# Altium project MPG2.PrjPcb
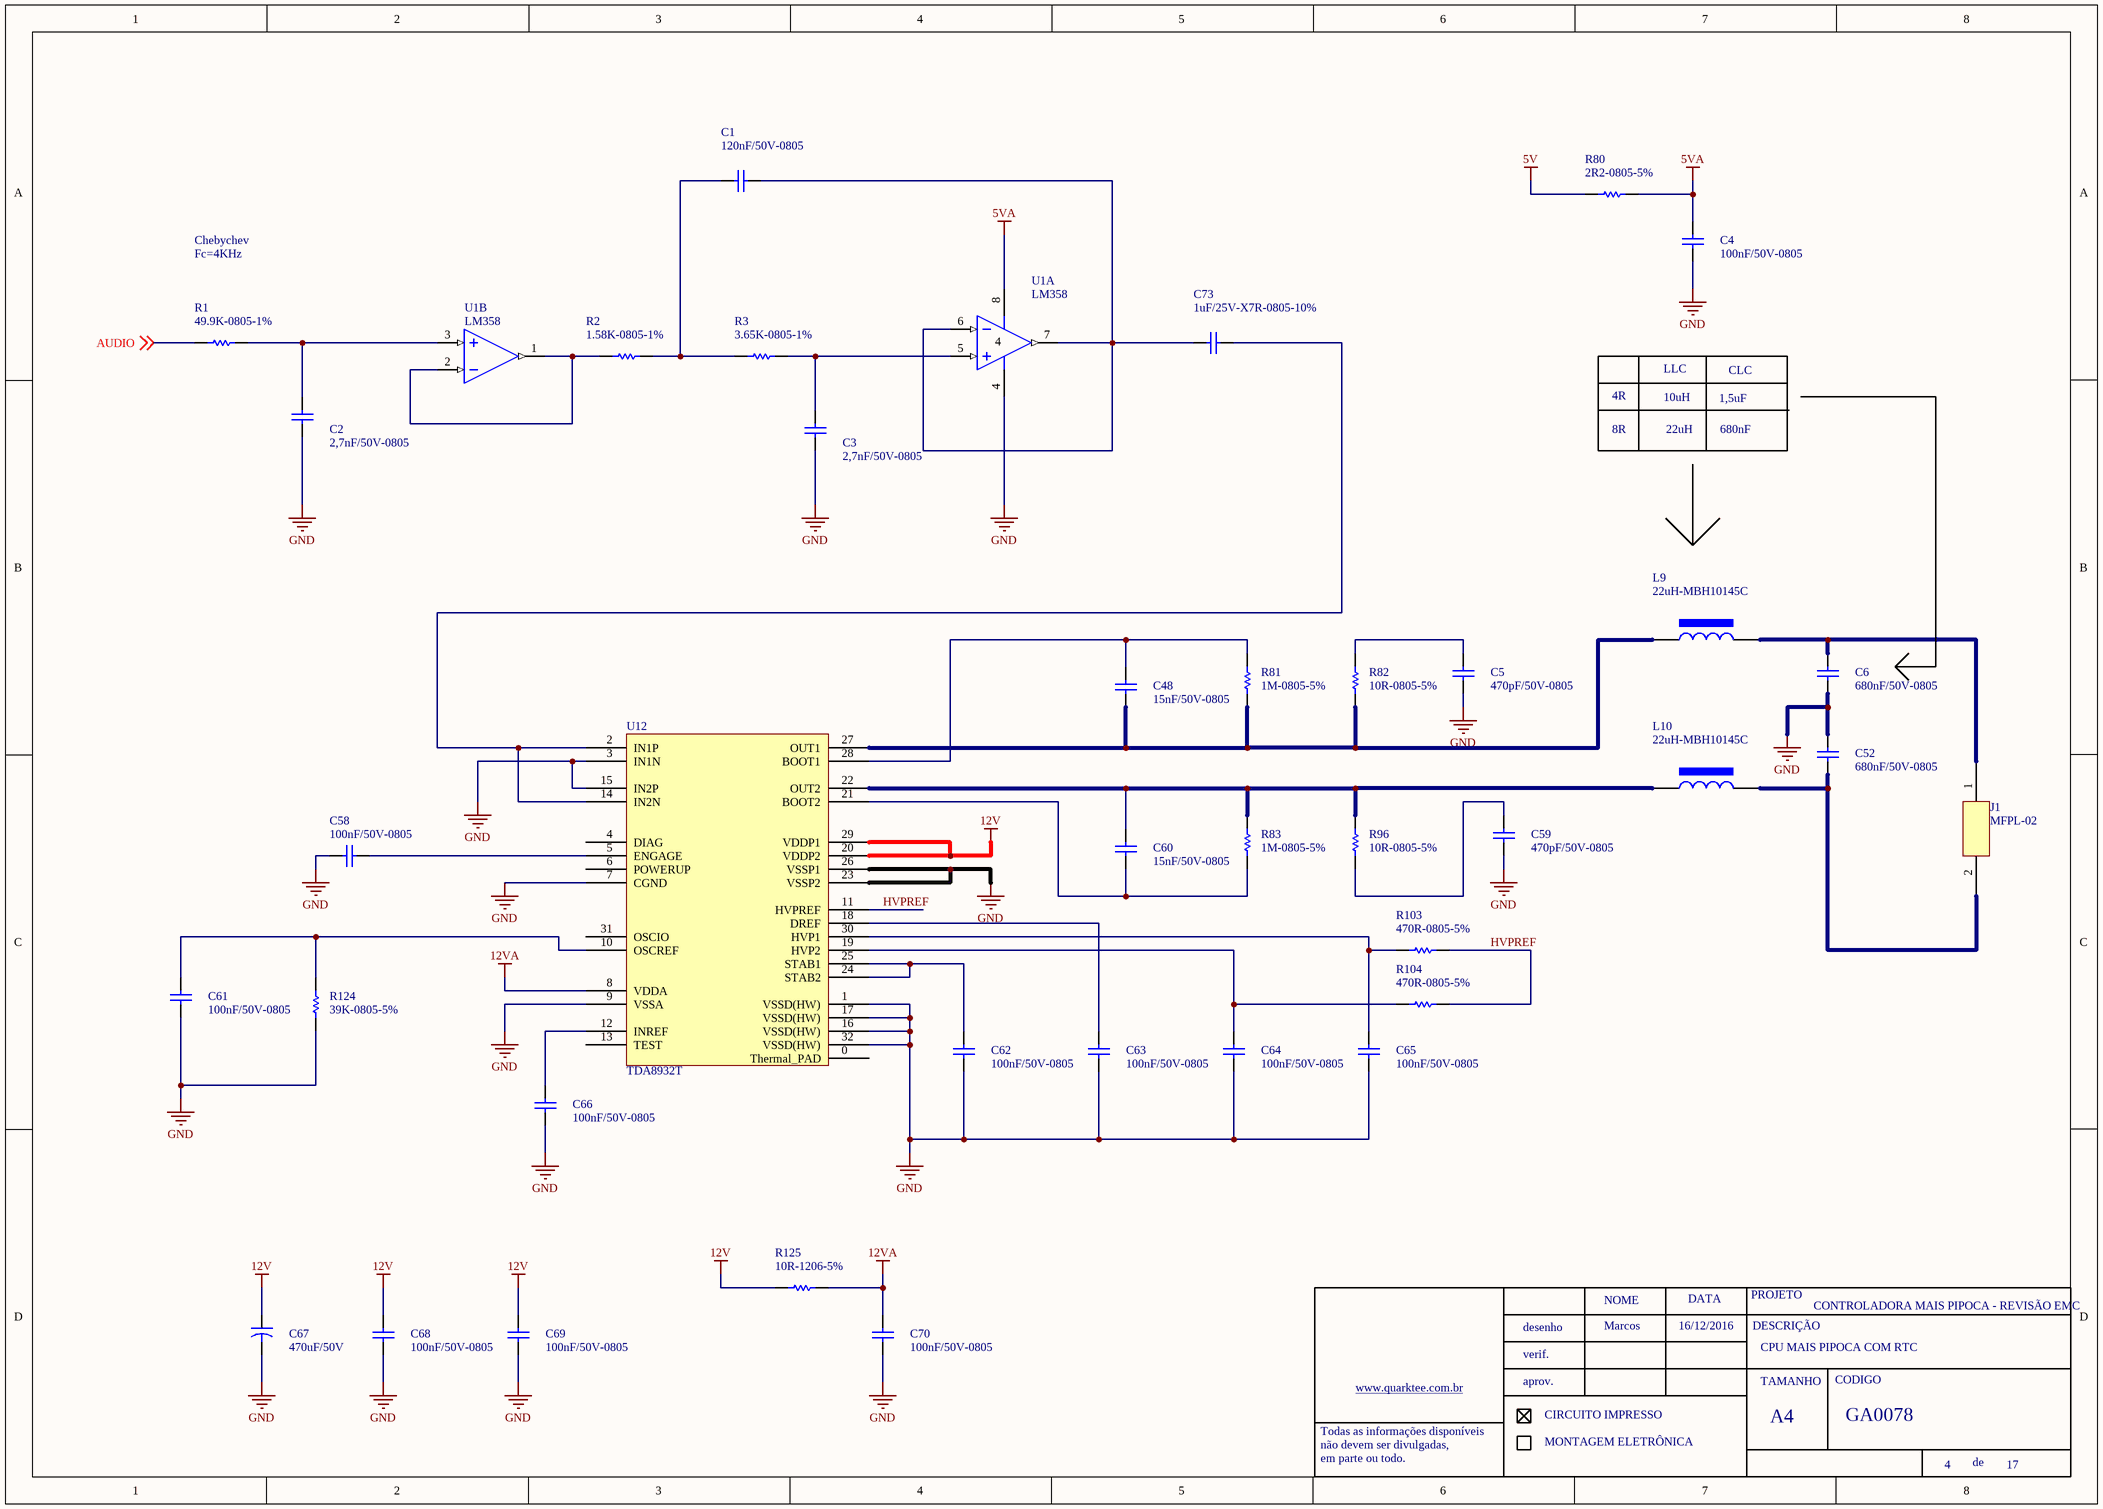
[diagram p0: amplificadorAudio.SchDoc]
9 sheets, 195 parts. Net scope: global (net labels, ports and power ports of the same name join across sheets).
Sheets:
  amplificadorAudio.SchDoc
  Barreira_pacote.SchDoc
  CPU.SchDoc
  IHM.SchDoc
  InterfaceConfiguracao.SchDoc
  JTAG.SchDoc
  Meios_pagamento.SchDoc
  Porta_MDB.SchDoc
  Regulador.SchDoc

## Sheet amplificadorAudio.SchDoc: CONTROLADORA MAIS PIPOCA - REVISÃO EMC
size A3; DocumentNumber: GA0078; SheetNumber: 4; SheetTotal: 17

### Parts
C1  120nF/50V-0805  [0805-REVISADO ONDA]
C2  2,7nF/50V-0805  [0805-REVISADO ONDA]
C3  2,7nF/50V-0805  [0805-REVISADO ONDA]
C4  100nF/50V-0805  [0805-REVISADO ONDA]
C5  470pF/50V-0805  [0805-REVISADO ONDA]
C6  680nF/50V-0805  [0805-REVISADO ONDA]
C48  15nF/50V-0805  [0805-REVISADO ONDA]
C52  680nF/50V-0805  [0805-REVISADO ONDA]
C58  100nF/50V-0805  [0805-REVISADO ONDA]
C59  470pF/50V-0805  [0805-REVISADO ONDA]
C60  15nF/50V-0805  [0805-REVISADO ONDA]
C61  100nF/50V-0805  [0805-REVISADO ONDA]
C62  100nF/50V-0805  [0805-REVISADO ONDA]
C63  100nF/50V-0805  [0805-REVISADO ONDA]
C64  100nF/50V-0805  [0805-REVISADO ONDA]
C65  100nF/50V-0805  [0805-REVISADO ONDA]
C66  100nF/50V-0805  [0805-REVISADO ONDA]
C67  470uF/50V
C68  100nF/50V-0805  [0805-REVISADO ONDA]
C69  100nF/50V-0805  [0805-REVISADO ONDA]
C70  100nF/50V-0805  [0805-REVISADO ONDA]
C73  1uF/25V-X7R-0805-10%  [0805-REVISADO ONDA]
J1  MFPL-02  [MFPL-02]
L9  22uH-MBH10145C
L10  22uH-MBH10145C
R1  49.9K-0805-1%  [0805-REVISADO ONDA]
R2  1.58K-0805-1%  [0805-REVISADO ONDA]
R3  3.65K-0805-1%  [0805-REVISADO ONDA]
R80  2R2-0805-5%
R81  1M-0805-5%  [0805-REVISADO ONDA]
R82  10R-0805-5%  [0805-REVISADO ONDA]
R83  1M-0805-5%  [0805-REVISADO ONDA]
R96  10R-0805-5%  [0805-REVISADO ONDA]
R103  470R-0805-5%  [0805-REVISADO ONDA]
R104  470R-0805-5%  [0805-REVISADO ONDA]
R124  39K-0805-5%  [0805-REVISADO ONDA]
R125  10R-1206-5%
U1  LM358  (parts A,B of 2)
U12  TDA8932T

### Nets
5V: R80.1
5VA: C4.2 R80.2 U1.8(V+)
12V: C67.1 C68.2 C69.2 R125.1 U12.20(VDDP2) U12.29(VDDP1)
12VA: C70.2 R125.2 U12.8(VDDA)
GND: C2.1 C3.1 C4.1 C5.1 C6.1 C52.2 C58.2 C59.1 C61.1 C62.1 C63.1 C64.1 C65.1 C66.1 C67.2 C68.1 C69.1 C70.1 R124.1 U1.4(GND) U12.1(VSSD(HW)) U12.3(IN1N) U12.7(CGND) U12.9(VSSA) U12.15(IN2P) U12.16(VSSD(HW)) U12.17(VSSD(HW)) U12.23(VSSP2) U12.26(VSSP1) U12.32(VSSD(HW))
AUDIO: R1.1 ; off-sheet AUDIO
HVPREF: R103.1 R104.1 U12.11(HVPREF)
NetC1_1: C1.1 C73.2 U1.6(IN-) U1.7(OUT)
NetC1_2: C1.2 R2.2 R3.1
NetC2_2: C2.2 R1.2 U1.3(IN+)
NetC3_2: C3.2 R3.2 U1.5(IN+)
NetC5_2: C5.2 R82.1
NetC6_2: C6.2 J1.1 L9.1
NetC48_1: C48.1 L9.2 R81.2 R82.2 U12.27(OUT1)
NetC48_2: C48.2 R81.1 U12.28(BOOT1)
NetC52_1: C52.1 J1.2 L10.1
NetC58_1: C58.1 U12.5(ENGAGE)
NetC59_2: C59.2 R96.2
NetC60_1: C60.1 R83.2 U12.21(BOOT2)
NetC60_2: C60.2 L10.2 R83.1 R96.1 U12.22(OUT2)
NetC61_2: C61.2 R124.2 U12.10(OSCREF)
NetC62_2: C62.2 U12.24(STAB2) U12.25(STAB1)
NetC63_2: C63.2 U12.18(DREF)
NetC64_2: C64.2 R104.2 U12.19(HVP2)
NetC65_2: C65.2 R103.2 U12.30(HVP1)
NetC66_2: C66.2 U12.12(INREF)
NetC73_1: C73.1 U12.2(IN1P) U12.14(IN2N)
NetR2_1: R2.1 U1.1(OUT) U1.2(IN-)

Not connected (* = marked no-connect by the designer): U12 0(Thermal_PAD) 4(DIAG) 6(POWERUP) 13(TEST) 31(OSCIO)

### Notes on the sheet
- Chebychev
- Fc=4KHz
- LLC
- CLC
- 4R
- 8R
- 10uH
- 22uH
- 1,5uF
- 680nF
- Marcos
- 16/12/2016
- CPU MAIS PIPOCA COM RTC
- NOME
- DATA
- PROJETO
- DESCRIÇÃO
- www.quarktee.com.br
- desenho
- verif.
- aprov.
- TAMANHO
- CODIGO
- Todas as informações disponíveis
- não devem ser divulgadas,
- em parte ou todo.
- CIRCUITO IMPRESSO
- MONTAGEM ELETRÔNICA
- A4
- de

### Library data of the parts
C1-C3 C5 C6 C48 C52 C59 C60 C73 = 100nF/50-0805-NPO: 100nF/50V-0805; ERP: 104.11.005
C4 C58 C61-C66 C68-C70 = 100nF/50-0805-NPO: ERP: 104.11.005
L9 L10 = indutor 1mH CNF15: 1mH-CNF15-26 AWG; ERP: 211.00.012
R1-R3 R81-R83 R96 R103 R104 R124 = 10K-0805-5%: ERP: 102.11.054
R80 R125 = 10R-0805-5%: ERP: 102.11.019
U1 = LM358: ERP: 10802003
C67 = 470uF/50V: ERP: 105.01.005

## Sheet Barreira_pacote.SchDoc: CONTROLADORA MAIS PIPOCA - REVISÃO EMC
size A3; DocumentNumber: GA0078; SheetNumber: 16; SheetTotal: 17
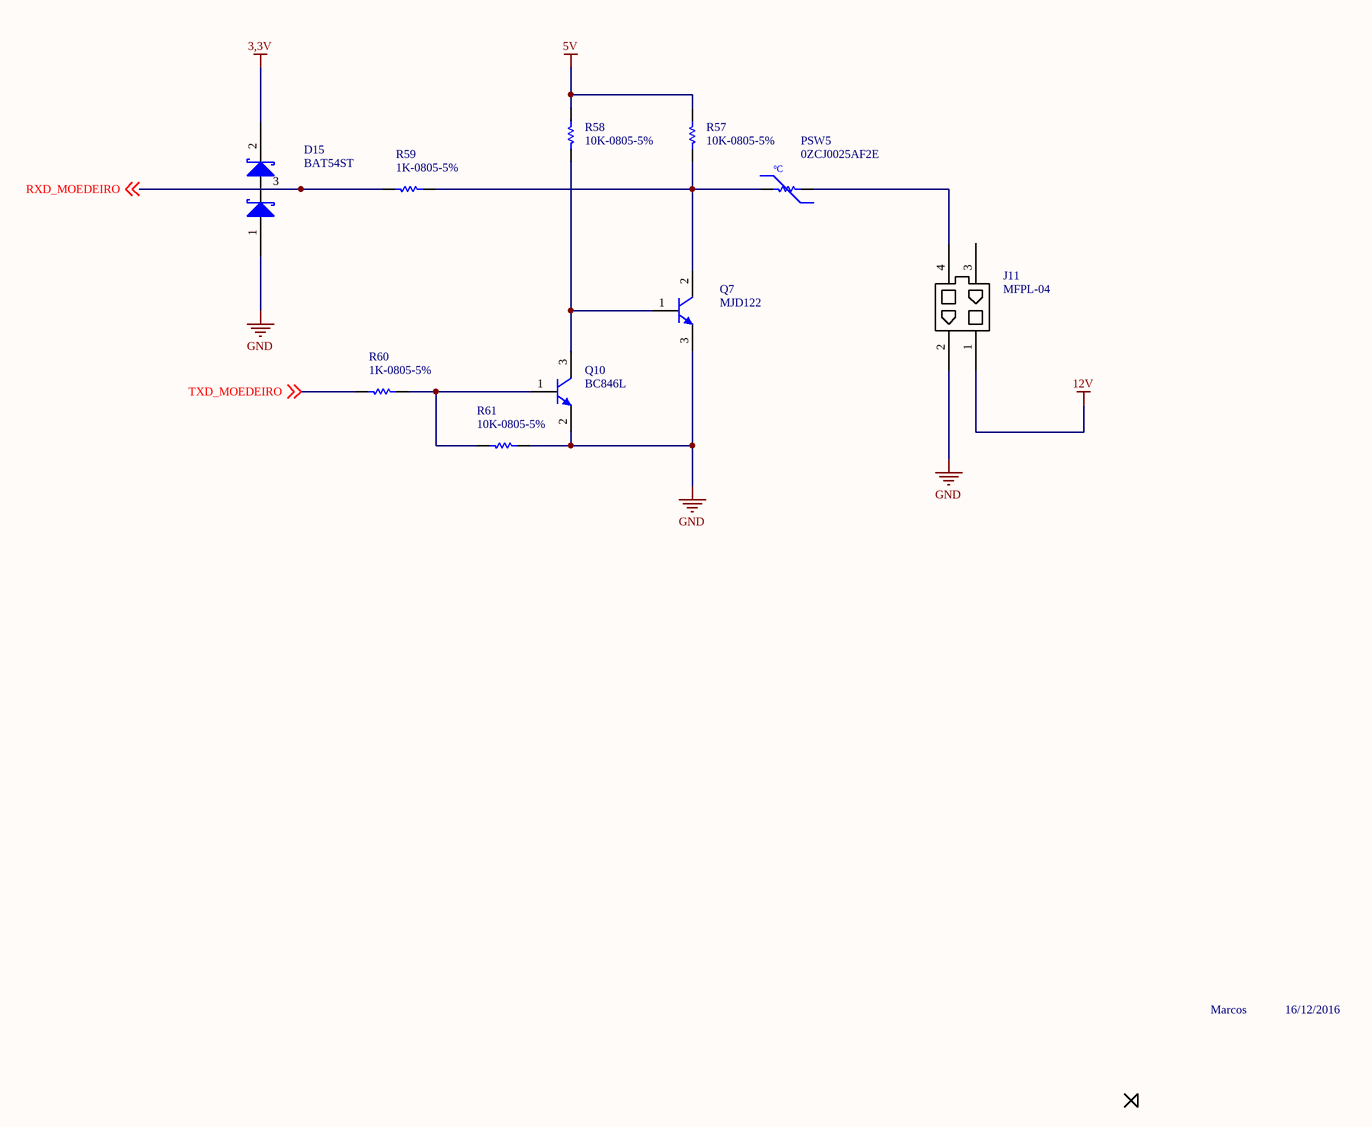
[diagram p1: Barreira_pacote.SchDoc]

### Parts
D15  BAT54ST  [SOT23 - REVISADO ONDA]
J11  MFPL-04
PSW5  0ZCJ0025AF2E  [1206-REVISADO ONDA]
Q7  MJD122  [DPAK REVISADO ONDA]
Q10  BC846L  [SOT23 - REVISADO ONDA]
R57  10K-0805-5%  [0805-REVISADO ONDA]
R58  10K-0805-5%  [0805-REVISADO ONDA]
R59  1K-0805-5%  [0805-REVISADO ONDA]
R60  1K-0805-5%  [0805-REVISADO ONDA]
R61  10K-0805-5%  [0805-REVISADO ONDA]

### Nets
3,3V: D15.2
5V: R57.2 R58.2
12V: J11.1
GND: D15.1 J11.2 Q7.3(E) Q10.2(E) R61.1
RXD_MOEDEIRO: D15.3 R59.2 ; off-sheet RXD_MOEDEIRO
TXD_MOEDEIRO: R60.2 ; off-sheet TXD_MOEDEIRO
NetJ11_4: J11.4 PSW5.1
NetPSW5_2: PSW5.2 Q7.2(C) R57.1 R59.1
NetQ7_1: Q7.1(B) Q10.3(C) R58.1
NetQ10_1: Q10.1(B) R60.1 R61.2

Not connected (* = marked no-connect by the designer): J11 3

### Notes on the sheet
- Marcos
- 16/12/2016
- NOME
- DATA
- PROJETO
- DESCRIÇÃO
- desenho
- verif.
- aprov.
- TAMANHO
- CODIGO
- Todas as informações disponíveis
- não devem ser divulgadas,
- em parte ou todo.
- www.quarktee.com.br
- CIRCUITO IMPRESSO
- MONTAGEM ELETRÔNICA
- A4
- de
- (in symbol PTC 2A-120V) ºC

### Library data of the parts
PSW5 = PTC 2A-120V
Q7 = MJD31
Q10 = BC846: ERP: 106.22.001
R57 R58 R61 = 10K-0805-5%: ERP: 102.11.054
R59 R60 = 1K-0805-5%: ERP: 102.11.042

## Sheet CPU.SchDoc: CONTROLADORA MAIS PIPOCA - REVISÃO EMC
size A3; DocumentNumber: GA0078; SheetNumber: 3; SheetTotal: 17
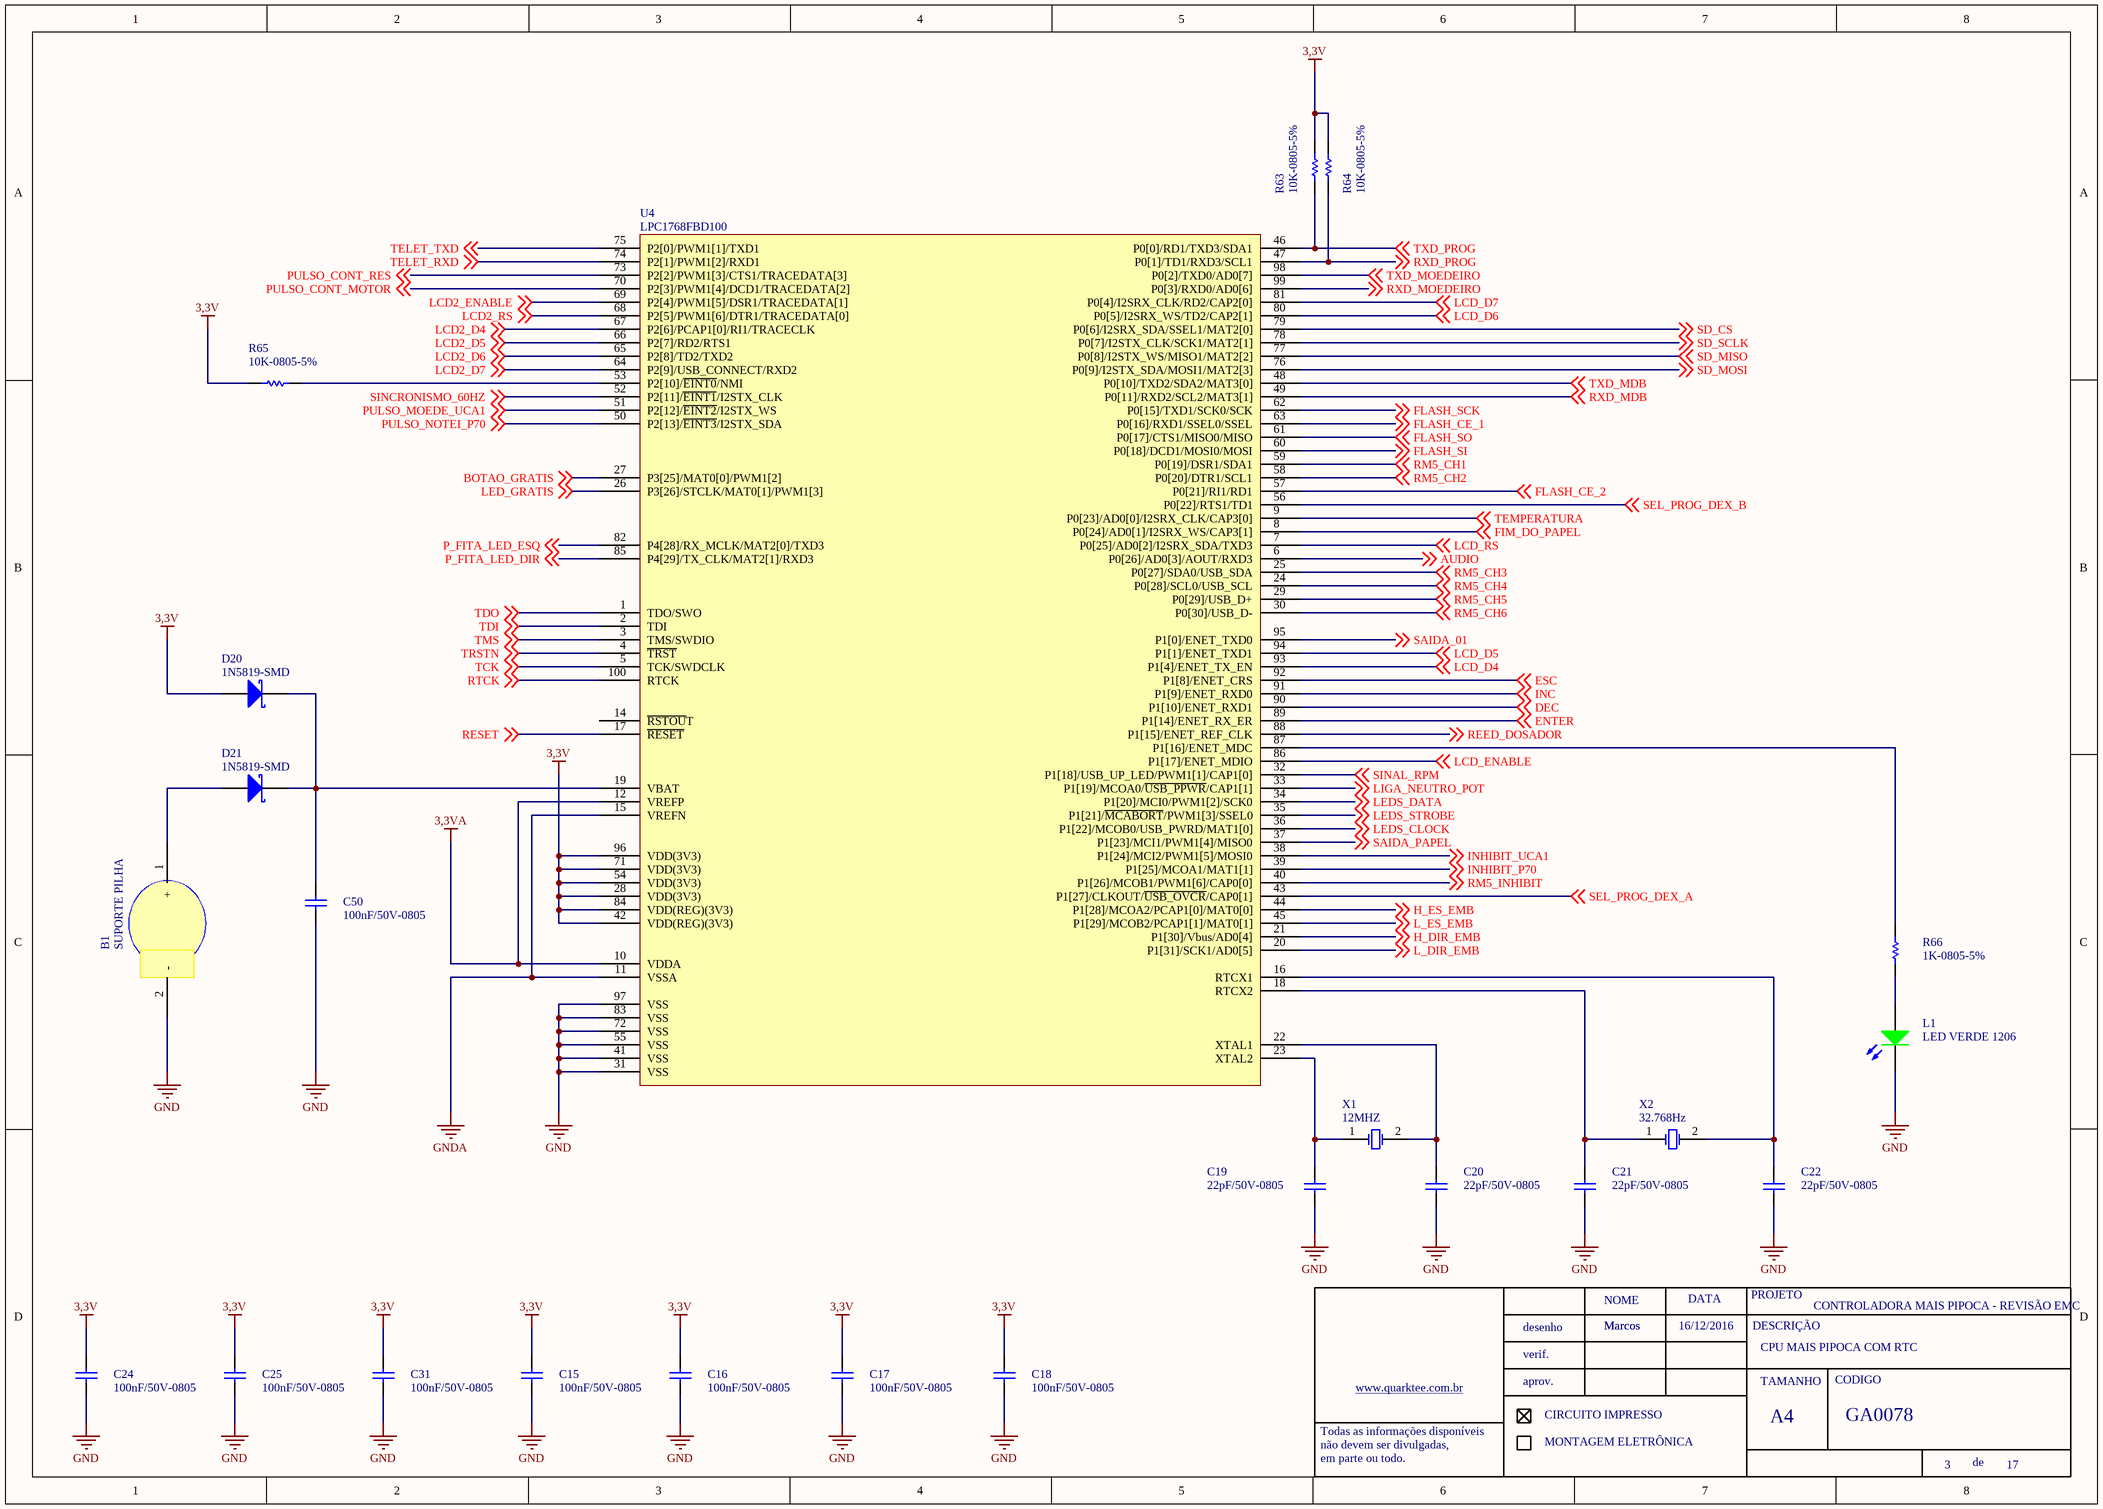
[diagram p2: CPU.SchDoc]

### Parts
B1  SUPORTE PILHA  [SUPORTE PILHA CR2032]
C15  100nF/50V-0805  [0805-REVISADO ONDA]
C16  100nF/50V-0805  [0805-REVISADO ONDA]
C17  100nF/50V-0805  [0805-REVISADO ONDA]
C18  100nF/50V-0805  [0805-REVISADO ONDA]
C19  22pF/50V-0805  [0805-REVISADO ONDA]
C20  22pF/50V-0805  [0805-REVISADO ONDA]
C21  22pF/50V-0805  [0805-REVISADO ONDA]
C22  22pF/50V-0805  [0805-REVISADO ONDA]
C24  100nF/50V-0805  [0805-REVISADO ONDA]
C25  100nF/50V-0805  [0805-REVISADO ONDA]
C31  100nF/50V-0805  [0805-REVISADO ONDA]
C50  100nF/50V-0805  [0805-REVISADO ONDA]
D20  1N5819-SMD
D21  1N5819-SMD
L1  LED VERDE 1206  [LED 1206]
R63  10K-0805-5%  [0805-REVISADO ONDA]
R64  10K-0805-5%  [0805-REVISADO ONDA]
R65  10K-0805-5%  [0805-REVISADO ONDA]
R66  1K-0805-5%  [0805-REVISADO ONDA]
U4  LPC1768FBD100  [LQFP-100 pasta]
X1  12MHZ  [HC49USM]
X2  32.768Hz  [CRISTAL TH3]

### Nets
3,3V: C15.2 C16.2 C17.2 C18.2 C24.2 C25.2 C31.2 D20.1(A) R63.2 R64.2 R65.1 U4.28(VDD(3V3)) U4.42(VDD(REG)(3V3)) U4.54(VDD(3V3)) U4.71(VDD(3V3)) U4.84(VDD(REG)(3V3)) U4.96(VDD(3V3))
3,3VA: U4.10(VDDA) U4.12(VREFP)
GND: B1.2(-) C15.1 C16.1 C17.1 C18.1 C19.1 C20.1 C21.1 C22.1 C24.1 C25.1 C31.1 C50.1 L1.2(K) U4.31(VSS) U4.41(VSS) U4.55(VSS) U4.72(VSS) U4.83(VSS) U4.97(VSS)
GNDA: U4.11(VSSA) U4.15(VREFN)
AUDIO: U4.6(P0[26]/AD0[3]/AOUT/RXD3) ; off-sheet AUDIO
BOTAO_GRATIS: U4.27(P3[25]/MAT0[0]/PWM1[2]) ; off-sheet BOTAO_GRATIS
DEC: U4.90(P1[10]/ENET_RXD1) ; off-sheet DEC
ENTER: U4.89(P1[14]/ENET_RX_ER) ; off-sheet ENTER
ESC: U4.92(P1[8]/ENET_CRS) ; off-sheet ESC
FIM_DO_PAPEL: U4.8(P0[24]/AD0[1]/I2SRX_WS/CAP3[1]) ; off-sheet FIM_DO_PAPEL
FLASH_CE_1: U4.63(P0[16]/RXD1/SSEL0/SSEL) ; off-sheet FLASH_CE_1
FLASH_CE_2: U4.57(P0[21]/RI1/RD1) ; off-sheet FLASH_CE_2
FLASH_SCK: U4.62(P0[15]/TXD1/SCK0/SCK) ; off-sheet FLASH_SCK
FLASH_SI: U4.60(P0[18]/DCD1/MOSI0/MOSI) ; off-sheet FLASH_SI
FLASH_SO: U4.61(P0[17]/CTS1/MISO0/MISO) ; off-sheet FLASH_SO
H_DIR_EMB: U4.21(P1[30]/Vbus/AD0[4]) ; off-sheet H_DIR_EMB
H_ES_EMB: U4.44(P1[28]/MCOA2/PCAP1[0]/MAT0[0]) ; off-sheet H_ES_EMB
INC: U4.91(P1[9]/ENET_RXD0) ; off-sheet INC
INHIBIT_P70: U4.39(P1[25]/MCOA1/MAT1[1]) ; off-sheet INHIBIT_P70
INHIBIT_UCA1: U4.38(P1[24]/MCI2/PWM1[5]/MOSI0) ; off-sheet INHIBIT_UCA1
L_DIR_EMB: U4.20(P1[31]/SCK1/AD0[5]) ; off-sheet L_DIR_EMB
L_ES_EMB: U4.45(P1[29]/MCOB2/PCAP1[1]/MAT0[1]) ; off-sheet L_ES_EMB
LCD2_D4: U4.67(P2[6]/PCAP1[0]/RI1/TRACECLK) ; off-sheet LCD2_D4
LCD2_D5: U4.66(P2[7]/RD2/RTS1) ; off-sheet LCD2_D5
LCD2_D6: U4.65(P2[8]/TD2/TXD2) ; off-sheet LCD2_D6
LCD2_D7: U4.64(P2[9]/USB_CONNECT/RXD2) ; off-sheet LCD2_D7
LCD2_ENABLE: U4.69(P2[4]/PWM1[5]/DSR1/TRACEDATA[1]) ; off-sheet LCD2_ENABLE
LCD2_RS: U4.68(P2[5]/PWM1[6]/DTR1/TRACEDATA[0]) ; off-sheet LCD2_RS
LCD_D4: U4.93(P1[4]/ENET_TX_EN) ; off-sheet LCD_D4
LCD_D5: U4.94(P1[1]/ENET_TXD1) ; off-sheet LCD_D5
LCD_D6: U4.80(P0[5]/I2SRX_WS/TD2/CAP2[1]) ; off-sheet LCD_D6
LCD_D7: U4.81(P0[4]/I2SRX_CLK/RD2/CAP2[0]) ; off-sheet LCD_D7
LCD_ENABLE: U4.86(P1[17]/ENET_MDIO) ; off-sheet LCD_ENABLE
LCD_RS: U4.7(P0[25]/AD0[2]/I2SRX_SDA/TXD3) ; off-sheet LCD_RS
LED_GRATIS: U4.26(P3[26]/STCLK/MAT0[1]/PWM1[3]) ; off-sheet LED_GRATIS
LEDS_CLOCK: U4.36(P1[22]/MCOB0/USB_PWRD/MAT1[0]) ; off-sheet LEDS_CLOCK
LEDS_DATA: U4.34(P1[20]/MCI0/PWM1[2]/SCK0) ; off-sheet LEDS_DATA
LEDS_STROBE: U4.35(P1[21]/~{MCABORT}/PWM1[3]/SSEL0) ; off-sheet LEDS_STROBE
LIGA_NEUTRO_POT: U4.33(P1[19]/MCOA0/~{USB_PPWR}/CAP1[1]) ; off-sheet LIGA_NEUTRO_POT
P_FITA_LED_DIR: U4.85(P4[29]/TX_CLK/MAT2[1]/RXD3) ; off-sheet P_FITA_LED_DIR
P_FITA_LED_ESQ: U4.82(P4[28]/RX_MCLK/MAT2[0]/TXD3) ; off-sheet P_FITA_LED_ESQ
PULSO_CONT_MOTOR: U4.70(P2[3]/PWM1[4]/DCD1/TRACEDATA[2]) ; off-sheet PULSO_CONT_MOTOR
PULSO_CONT_RES: U4.73(P2[2]/PWM1[3]/CTS1/TRACEDATA[3]) ; off-sheet PULSO_CONT_RES
PULSO_MOEDE_UCA1: U4.51(P2[12]/~{EINT2}/I2STX_WS) ; off-sheet PULSO_MOEDE_UCA1
PULSO_NOTEI_P70: U4.50(P2[13]/~{EINT3}/I2STX_SDA) ; off-sheet PULSO_NOTEI_P70
REED_DOSADOR: U4.88(P1[15]/ENET_REF_CLK) ; off-sheet REED_DOSADOR
RESET: U4.17(~{RESET}) ; off-sheet RESET
RM5_CH1: U4.59(P0[19]/DSR1/SDA1) ; off-sheet RM5_CH1
RM5_CH2: U4.58(P0[20]/DTR1/SCL1) ; off-sheet RM5_CH2
RM5_CH3: U4.25(P0[27]/SDA0/USB_SDA) ; off-sheet RM5_CH3
RM5_CH4: U4.24(P0[28]/SCL0/USB_SCL) ; off-sheet RM5_CH4
RM5_CH5: U4.29(P0[29]/USB_D+) ; off-sheet RM5_CH5
RM5_CH6: U4.30(P0[30]/USB_D-) ; off-sheet RM5_CH6
RM5_INHIBIT: U4.40(P1[26]/MCOB1/PWM1[6]/CAP0[0]) ; off-sheet RM5_INHIBIT
RTCK: U4.100(RTCK) ; off-sheet RTCK
RXD_MDB: U4.49(P0[11]/RXD2/SCL2/MAT3[1]) ; off-sheet RXD_MDB
RXD_MOEDEIRO: U4.99(P0[3]/RXD0/AD0[6]) ; off-sheet RXD_MOEDEIRO
RXD_PROG: R64.1 U4.47(P0[1]/TD1/RXD3/SCL1) ; off-sheet RXD_PROG
SAIDA_01: U4.95(P1[0]/ENET_TXD0) ; off-sheet SAIDA_01
SAIDA_PAPEL: U4.37(P1[23]/MCI1/PWM1[4]/MISO0) ; off-sheet SAIDA_PAPEL
SD_CS: U4.79(P0[6]/I2SRX_SDA/SSEL1/MAT2[0]) ; off-sheet SD_CS
SD_MISO: U4.77(P0[8]/I2STX_WS/MISO1/MAT2[2]) ; off-sheet SD_MISO
SD_MOSI: U4.76(P0[9]/I2STX_SDA/MOSI1/MAT2[3]) ; off-sheet SD_MOSI
SD_SCLK: U4.78(P0[7]/I2STX_CLK/SCK1/MAT2[1]) ; off-sheet SD_SCLK
SEL_PROG_DEX_A: U4.43(P1[27]/CLKOUT/~{USB_OVCR}/CAP0[1]) ; off-sheet SEL_PROG_DEX_A
SEL_PROG_DEX_B: U4.56(P0[22]/RTS1/TD1) ; off-sheet SEL_PROG_DEX_B
SINAL_RPM: U4.32(P1[18]/USB_UP_LED/PWM1[1]/CAP1[0]) ; off-sheet SINAL_RPM
SINCRONISMO_60HZ: U4.52(P2[11]/~{EINT1}/I2STX_CLK) ; off-sheet SINCRONISMO_60HZ
TCK: U4.5(TCK/SWDCLK) ; off-sheet TCK
TDI: U4.2(TDI) ; off-sheet TDI
TDO: U4.1(TDO/SWO) ; off-sheet TDO
TELET_RXD: U4.74(P2[1]/PWM1[2]/RXD1) ; off-sheet TELET_RXD
TELET_TXD: U4.75(P2[0]/PWM1[1]/TXD1) ; off-sheet TELET_TXD
TEMPERATURA: U4.9(P0[23]/AD0[0]/I2SRX_CLK/CAP3[0]) ; off-sheet TEMPERATURA
TMS: U4.3(TMS/SWDIO) ; off-sheet TMS
TRSTN: U4.4(~{TRST}) ; off-sheet TRSTN
TXD_MDB: U4.48(P0[10]/TXD2/SDA2/MAT3[0]) ; off-sheet TXD_MDB
TXD_MOEDEIRO: U4.98(P0[2]/TXD0/AD0[7]) ; off-sheet TXD_MOEDEIRO
TXD_PROG: R63.1 U4.46(P0[0]/RD1/TXD3/SDA1) ; off-sheet TXD_PROG
NetB1_1: B1.1(+) D21.1(A)
NetC19_2: C19.2 U4.23(XTAL2) X1.1(OSC1)
NetC20_2: C20.2 U4.22(XTAL1) X1.2(OSC2)
NetC21_2: C21.2 U4.18(RTCX2) X2.1(OSC1)
NetC22_2: C22.2 U4.16(RTCX1) X2.2(OSC2)
NetC50_2: C50.2 D20.2(K) D21.2(K) U4.19(VBAT)
NetL1_1: L1.1(A) R66.1
NetR65_2: R65.2 U4.53(P2[10]/~{EINT0}/NMI)
NetR66_2: R66.2 U4.87(P1[16]/ENET_MDC)

Not connected (* = marked no-connect by the designer): U4 14(~{RSTOU}T)

### Notes on the sheet
- Marcos
- 16/12/2016
- CPU MAIS PIPOCA COM RTC
- NOME
- DATA
- PROJETO
- DESCRIÇÃO
- www.quarktee.com.br
- desenho
- verif.
- aprov.
- TAMANHO
- CODIGO
- Todas as informações disponíveis
- não devem ser divulgadas,
- em parte ou todo.
- CIRCUITO IMPRESSO
- MONTAGEM ELETRÔNICA
- A4
- de

### Library data of the parts
B1 = SUPORTE PILHA CR2032: ERP: 437.00.100
C15-C18 C24 C25 C31 C50 = 100nF/50-0805-NPO: ERP: 104.11.005
C19-C22 = 22pF-0805-NPO: ERP: 104.11.001
D20 D21 = 1N5819: ERP: 121.20.002
L1 = LED VERDE 0603 SMD: LED VERDE 0603 VERDE; ERP: 124.02.011
U4 = LPC1768FDB100: ERP: 110.02.004
X1 = CRISTAL 12MHZ: ERP: 134.01.003
X2 = CRISTAL 32.768 Hz: CRISTAL 32.768Hz; ERP: 134.01.002
R63-R65 = 10K-0805-5%: ERP: 102.11.054
R66 = 1K-0805-5%: ERP: 102.11.042

## Sheet IHM.SchDoc: CONTROLADORA MAIS PIPOCA - REVISÃO EMC
size A3; DocumentNumber: GA0078; SheetNumber: 9; SheetTotal: 17
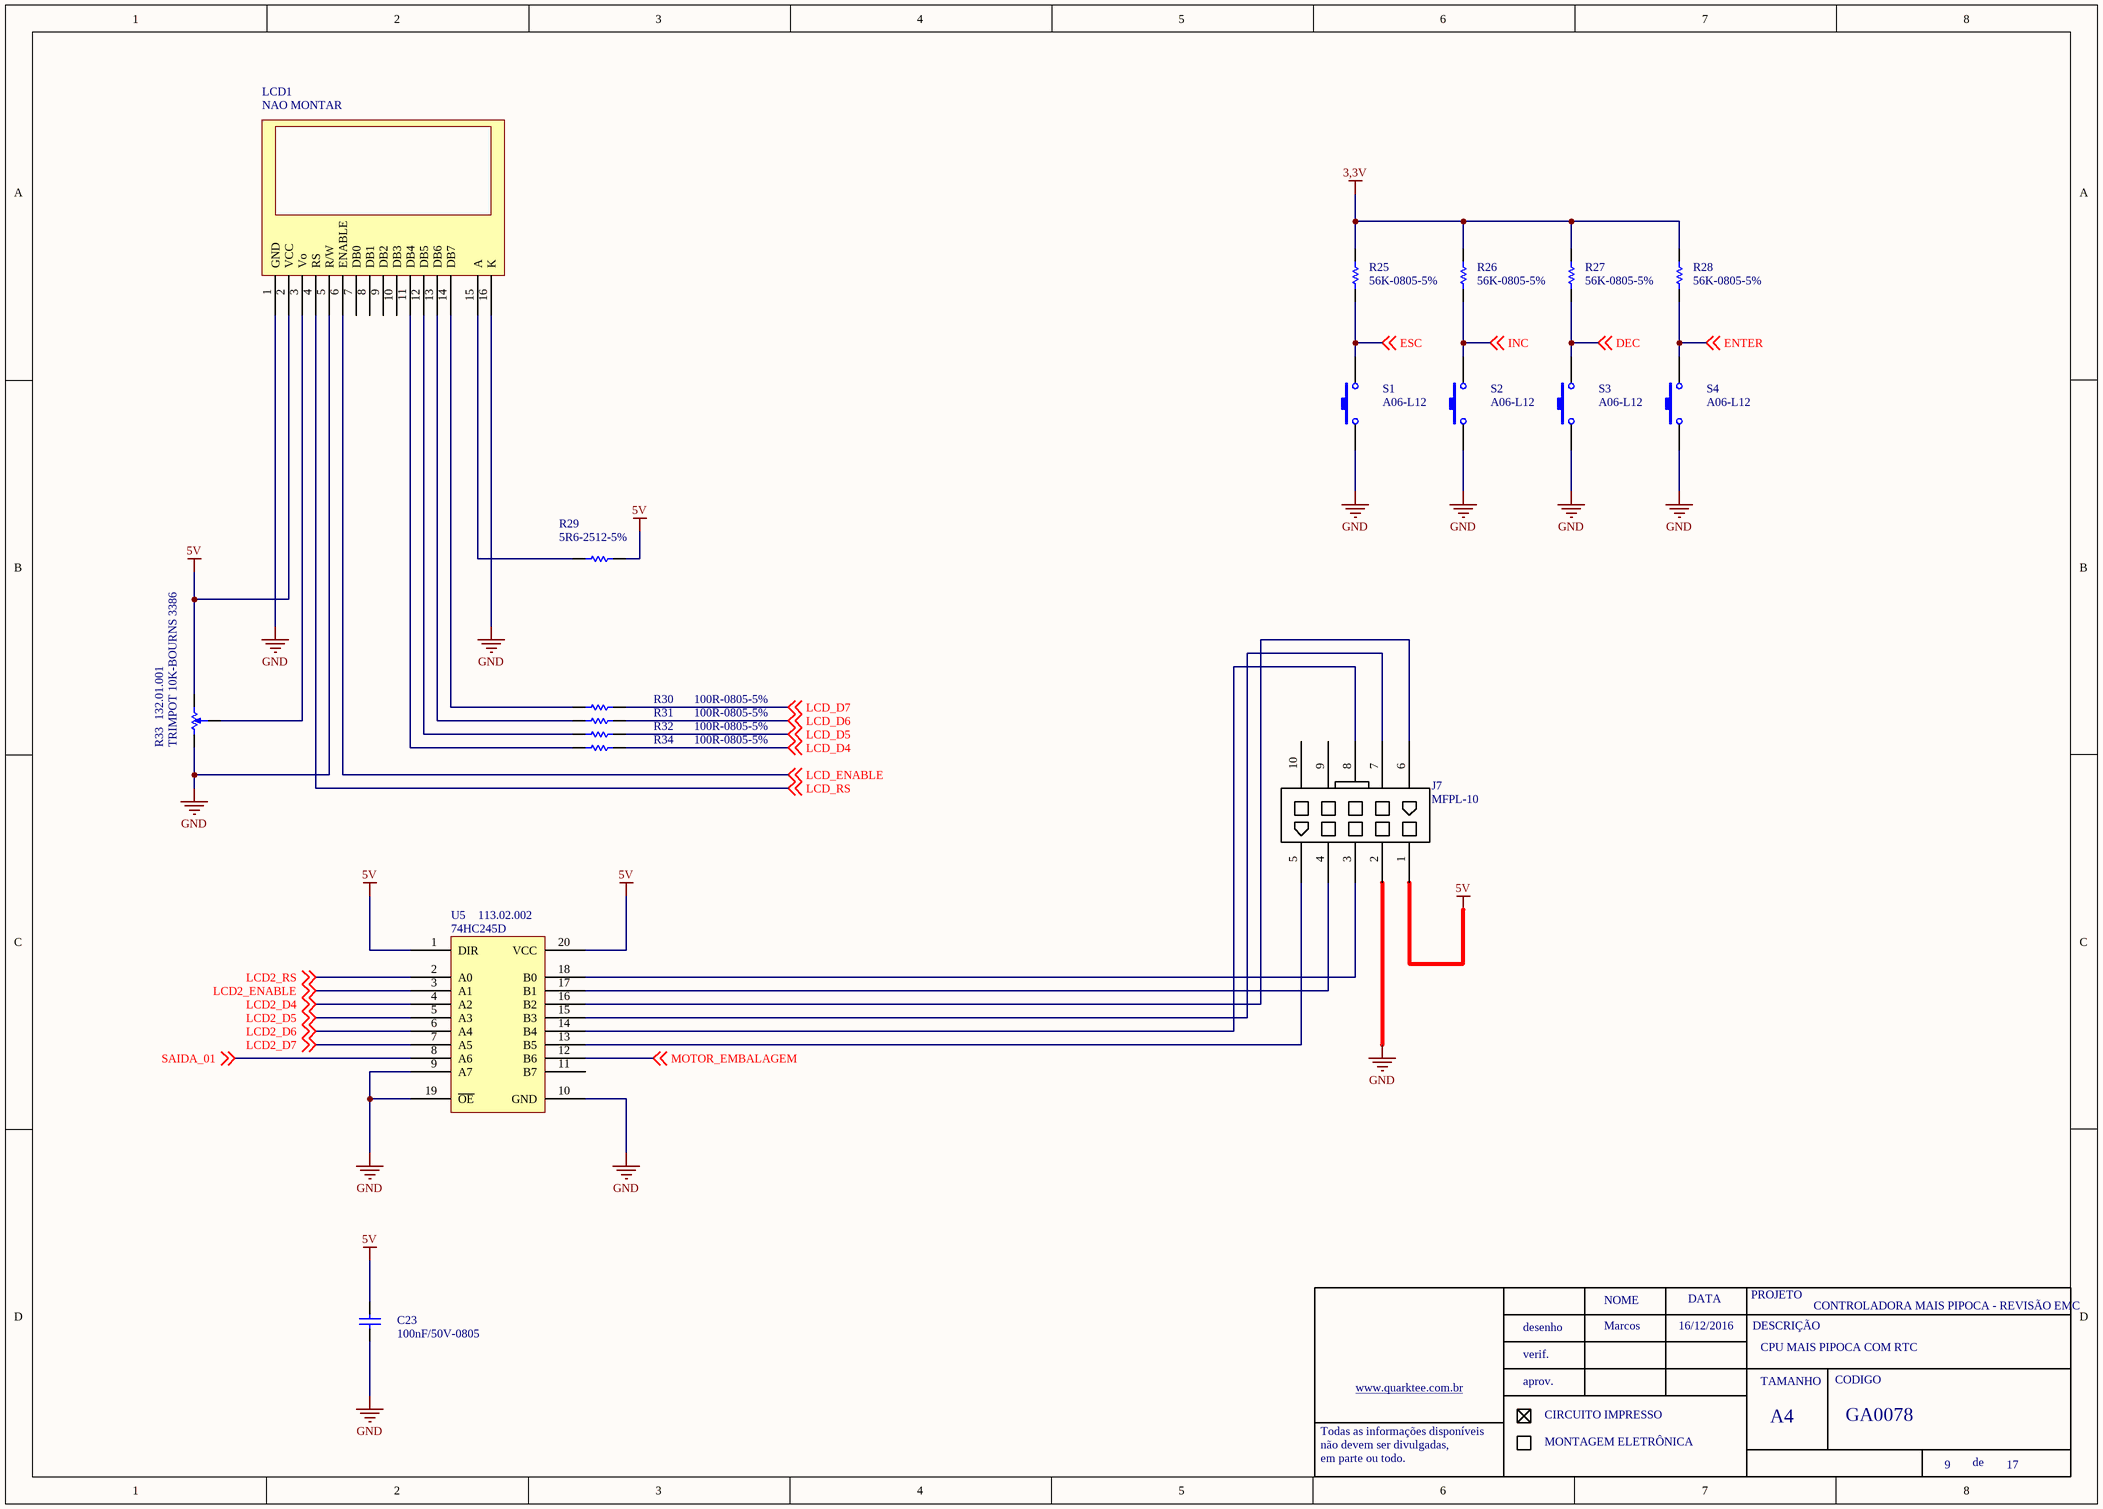
[diagram p3: IHM.SchDoc]

### Parts
C23  100nF/50V-0805  [0805-REVISADO ONDA]
J7  MFPL-10
LCD1  NAO MONTAR  [WH1602B_DS]
R25  56K-0805-5%  [0805-REVISADO ONDA]
R26  56K-0805-5%  [0805-REVISADO ONDA]
R27  56K-0805-5%  [0805-REVISADO ONDA]
R28  56K-0805-5%  [0805-REVISADO ONDA]
R29  5R6-2512-5%  [2512 - REVISADO ONDA]
R30  100R-0805-5%  [0805-REVISADO ONDA]
R31  100R-0805-5%  [0805-REVISADO ONDA]
R32  100R-0805-5%  [0805-REVISADO ONDA]
R33  TRIMPOT 10K-BOURNS 3386  ERP: 132.01.001  [TRIMPOT 3386]
R34  100R-0805-5%  [0805-REVISADO ONDA]
S1  A06-L12  [CHAVE_A06]
S2  A06-L12  [CHAVE_A06]
S3  A06-L12  [CHAVE_A06]
S4  A06-L12  [CHAVE_A06]
U5  74HC245D  ERP: 113.02.002  [SOIC-20]

### Nets
3,3V: R25.1 R26.1 R27.1 R28.1
5V: C23.2 J7.1 LCD1.2(VCC) R29.1 R33.1 U5.1(DIR) U5.20(VCC)
GND: C23.1 J7.2 LCD1.1(GND) LCD1.5(R/W) LCD1.16(K) R33.3 S1.1 S2.1 S3.1 S4.1 U5.9(A7) U5.10(GND) U5.19(~{OE})
DEC: R27.2 S3.2 ; off-sheet DEC
ENTER: R28.2 S4.2 ; off-sheet ENTER
ESC: R25.2 S1.2 ; off-sheet ESC
INC: R26.2 S2.2 ; off-sheet INC
LCD2_D4: U5.4(A2) ; off-sheet LCD2_D4
LCD2_D5: U5.5(A3) ; off-sheet LCD2_D5
LCD2_D6: U5.6(A4) ; off-sheet LCD2_D6
LCD2_D7: U5.7(A5) ; off-sheet LCD2_D7
LCD2_ENABLE: U5.3(A1) ; off-sheet LCD2_ENABLE
LCD2_RS: U5.2(A0) ; off-sheet LCD2_RS
LCD_D4: R34.2 ; off-sheet LCD_D4
LCD_D5: R32.2 ; off-sheet LCD_D5
LCD_D6: R31.2 ; off-sheet LCD_D6
LCD_D7: R30.2 ; off-sheet LCD_D7
LCD_ENABLE: LCD1.6(ENABLE) ; off-sheet LCD_ENABLE
LCD_RS: LCD1.4(RS) ; off-sheet LCD_RS
MOTOR_EMBALAGEM: U5.12(B6) ; off-sheet MOTOR_EMBALAGEM
SAIDA_01: U5.8(A6) ; off-sheet SAIDA_01
NetJ7_3: J7.3 U5.18(B0)
NetJ7_4: J7.4 U5.17(B1)
NetJ7_5: J7.5 U5.13(B5)
NetJ7_6: J7.6 U5.16(B2)
NetJ7_7: J7.7 U5.15(B3)
NetJ7_8: J7.8 U5.14(B4)
NetLCD1_3: LCD1.3(Vo) R33.2
NetLCD1_11: LCD1.11(DB4) R34.1
NetLCD1_12: LCD1.12(DB5) R32.1
NetLCD1_13: LCD1.13(DB6) R31.1
NetLCD1_14: LCD1.14(DB7) R30.1
NetLCD1_15: LCD1.15(A) R29.2

Not connected (* = marked no-connect by the designer): J7 9 10; LCD1 7(DB0) 8(DB1) 9(DB2) 10(DB3); U5 11(B7)

### Notes on the sheet
- Marcos
- 16/12/2016
- CPU MAIS PIPOCA COM RTC
- NOME
- DATA
- PROJETO
- DESCRIÇÃO
- www.quarktee.com.br
- desenho
- verif.
- aprov.
- TAMANHO
- CODIGO
- Todas as informações disponíveis
- não devem ser divulgadas,
- em parte ou todo.
- CIRCUITO IMPRESSO
- MONTAGEM ELETRÔNICA
- A4
- de

### Library data of the parts
C23 = 100nF/50-0805-NPO: ERP: 104.11.005
LCD1 = WH1602A: ERP: 131.00.001
R29 = RES 5R6-CR100: 5R6-CR100; ERP: 103.05.016
R33 = TRIMPOT 3386 50K
R25-R28 = 56K-0805-5%: ERP: 102.11.063
R30-R32 R34 = 100R-0805-5%: ERP: 102.11.031
S1-S4 = A06-L12: ERP: 136.00.001

## Sheet InterfaceConfiguracao.SchDoc: CONTROLADORA MAIS PIPOCA - REVISÃO EMC
size A3; DocumentNumber: GA0078; SheetNumber: 10; SheetTotal: 17
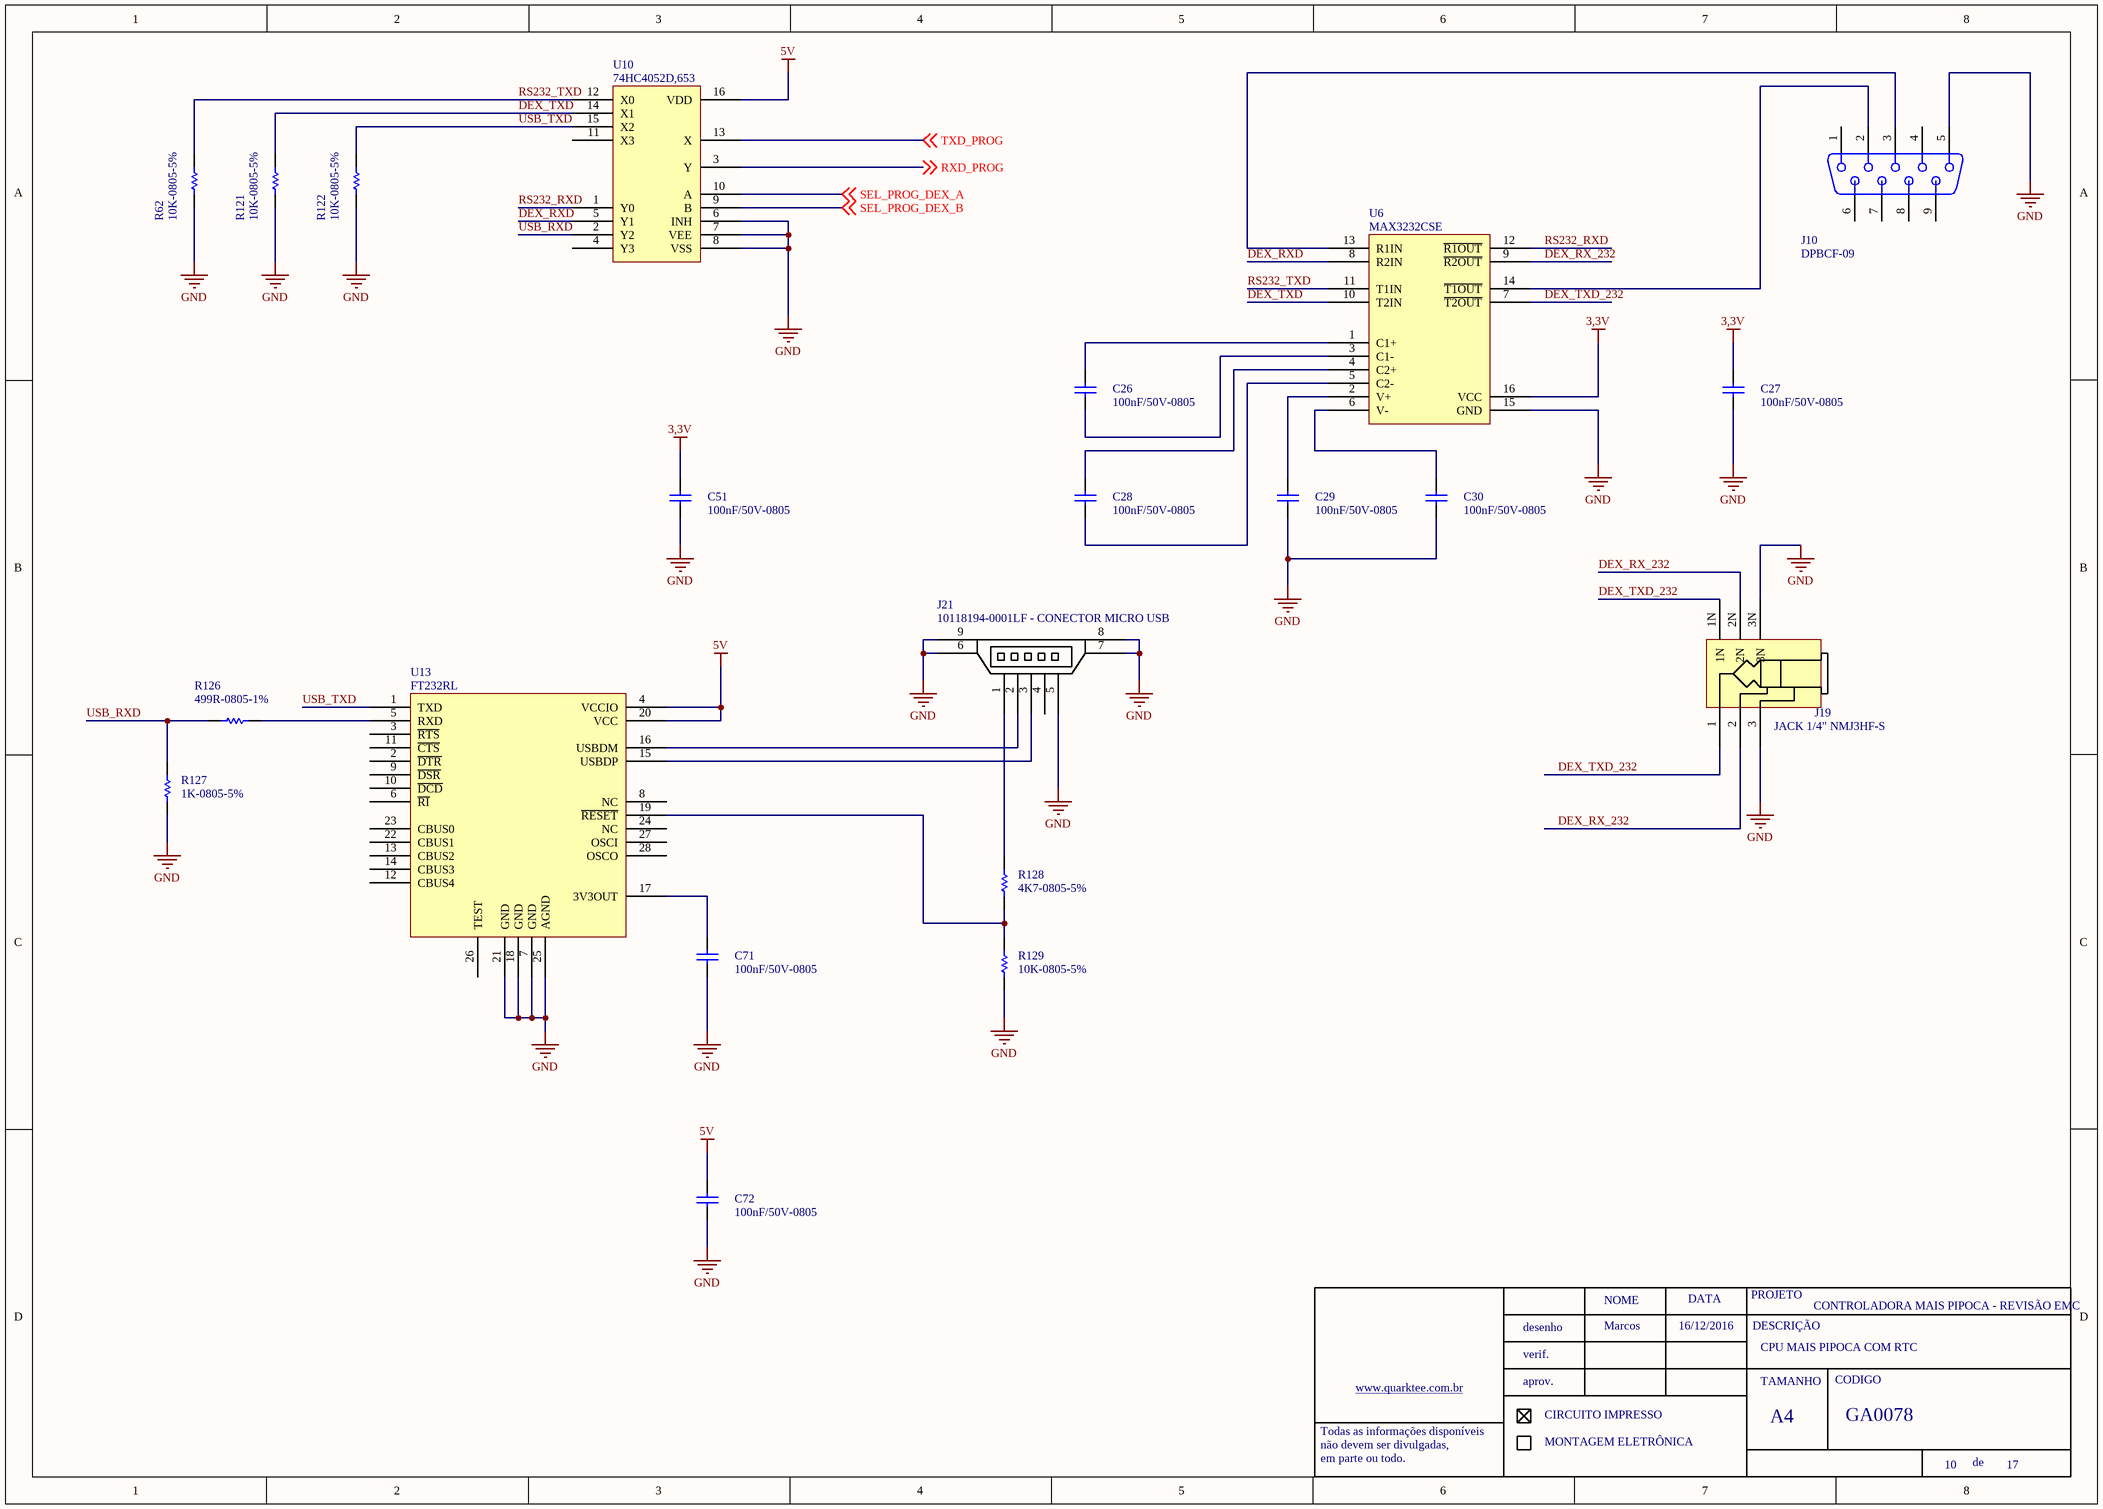
[diagram p4: InterfaceConfiguracao.SchDoc]

### Parts
C26  100nF/50V-0805  [0805-REVISADO ONDA]
C27  100nF/50V-0805  [0805-REVISADO ONDA]
C28  100nF/50V-0805  [0805-REVISADO ONDA]
C29  100nF/50V-0805  [0805-REVISADO ONDA]
C30  100nF/50V-0805  [0805-REVISADO ONDA]
C51  100nF/50V-0805  [0805-REVISADO ONDA]
C71  100nF/50V-0805  [0805-REVISADO ONDA]
C72  100nF/50V-0805  [0805-REVISADO ONDA]
J10  DPBCF-09  [DB9-FÊMEA MONTAGEM EM PCI 180]
J19  JACK 1/4" NMJ3HF-S
J21  10118194-0001LF - CONECTOR MICRO USB
R62  10K-0805-5%  [0805-REVISADO ONDA]
R121  10K-0805-5%  [0805-REVISADO ONDA]
R122  10K-0805-5%  [0805-REVISADO ONDA]
R126  499R-0805-1%  [0805-REVISADO ONDA]
R127  1K-0805-5%  [0805-REVISADO ONDA]
R128  4K7-0805-5%  [0805-REVISADO ONDA]
R129  10K-0805-5%  [0805-REVISADO ONDA]
U6  MAX3232CSE  [SOIC 16 PINOS]
U10  74HC4052D,653
U13  FT232RL

### Nets
3,3V: C27.2 C51.2 U6.16(VCC)
5V: C72.2 U10.16(VDD) U13.4(VCCIO) U13.20(VCC)
GND: C27.1 C29.1 C30.1 C51.1 C71.1 C72.1 J10.5 J19.3 J19.3N J21.5 J21.6 J21.7 J21.8 J21.9 R62.1 R121.1 R122.1 R127.1 R129.1 U6.15(GND) U10.6(INH) U10.7(VEE) U10.8(VSS) U13.7(GND) U13.18(GND) U13.21(GND) U13.25(AGND)
DEX_RX_232: J19.2 J19.2N U6.9(~{R2OUT})
DEX_RXD: U6.8(R2IN) U10.5(Y1)
DEX_TXD: R121.2 U6.10(T2IN) U10.14(X1)
DEX_TXD_232: J19.1 J19.1N U6.7(~{T2OUT})
RS232_RXD: U6.12(~{R1OUT}) U10.1(Y0)
RS232_TXD: R62.2 U6.11(T1IN) U10.12(X0)
RXD_PROG: U10.3(Y) ; off-sheet RXD_PROG
SEL_PROG_DEX_A: U10.10(A) ; off-sheet SEL_PROG_DEX_A
SEL_PROG_DEX_B: U10.9(B) ; off-sheet SEL_PROG_DEX_B
TXD_PROG: U10.13(X) ; off-sheet TXD_PROG
USB_RXD: R126.1 R127.2 U10.2(Y2)
USB_TXD: R122.2 U10.15(X2) U13.1(TXD)
NetC26_1: C26.1 U6.3(C1-)
NetC26_2: C26.2 U6.1(C1+)
NetC28_1: C28.1 U6.5(C2-)
NetC28_2: C28.2 U6.4(C2+)
NetC29_2: C29.2 U6.2(V+)
NetC30_2: C30.2 U6.6(V-)
NetC71_2: C71.2 U13.17(3V3OUT)
NetJ10_2: J10.2 U6.14(~{T1OUT})
NetJ10_3: J10.3 U6.13(R1IN)
NetJ21_1: J21.1 R128.2
NetJ21_2: J21.2 U13.16(USBDM)
NetJ21_3: J21.3 U13.15(USBDP)
NetR126_2: R126.2 U13.5(RXD)
NetR128_1: R128.1 R129.2 U13.19(~{RESET})

Not connected (* = marked no-connect by the designer): J10 1 4 6 7 8 9; J21 4; U10 4(Y3) 11(X3); U13 2(~{DTR}) 3(~{RTS}) 6(~{RI}) 8(NC) 9(~{DSR}) 10(~{DCD}) 11(~{CTS}) 12(CBUS4) 13(CBUS2) 14(CBUS3) 22(CBUS1) 23(CBUS0) 24(NC) 26(TEST) 27(OSCI) 28(OSCO)

### Notes on the sheet
- Marcos
- 16/12/2016
- CPU MAIS PIPOCA COM RTC
- NOME
- DATA
- PROJETO
- DESCRIÇÃO
- www.quarktee.com.br
- desenho
- verif.
- aprov.
- TAMANHO
- CODIGO
- Todas as informações disponíveis
- não devem ser divulgadas,
- em parte ou todo.
- CIRCUITO IMPRESSO
- MONTAGEM ELETRÔNICA
- A4
- de

### Library data of the parts
C26-C30 C51 C71 C72 = 100nF/50-0805-NPO: ERP: 104.11.005
J10 = DB-9 - FÊMEA 180º MONTAGEM EM PCI: DBPCF-09; ERP: 434.00.002
J19 = NMJ3HF-S
J21 = MINI_USB
R126 = 1K-0805-5%: ERP: 102.11.042
R128 = 10K-0805-5%: ERP: 102.11.054
U10 = CD74HC4052PWR
R62 R121 R122 R129 = 10K-0805-5%: ERP: 102.11.054
R127 = 1K-0805-5%: ERP: 102.11.042
U6 = MAX3232CSE: ERP: 110.02.001

## Sheet JTAG.SchDoc: CONTROLADORA MAIS PIPOCA - REVISÃO EMC
size A3; DocumentNumber: GA0078; SheetNumber: 13; SheetTotal: 17
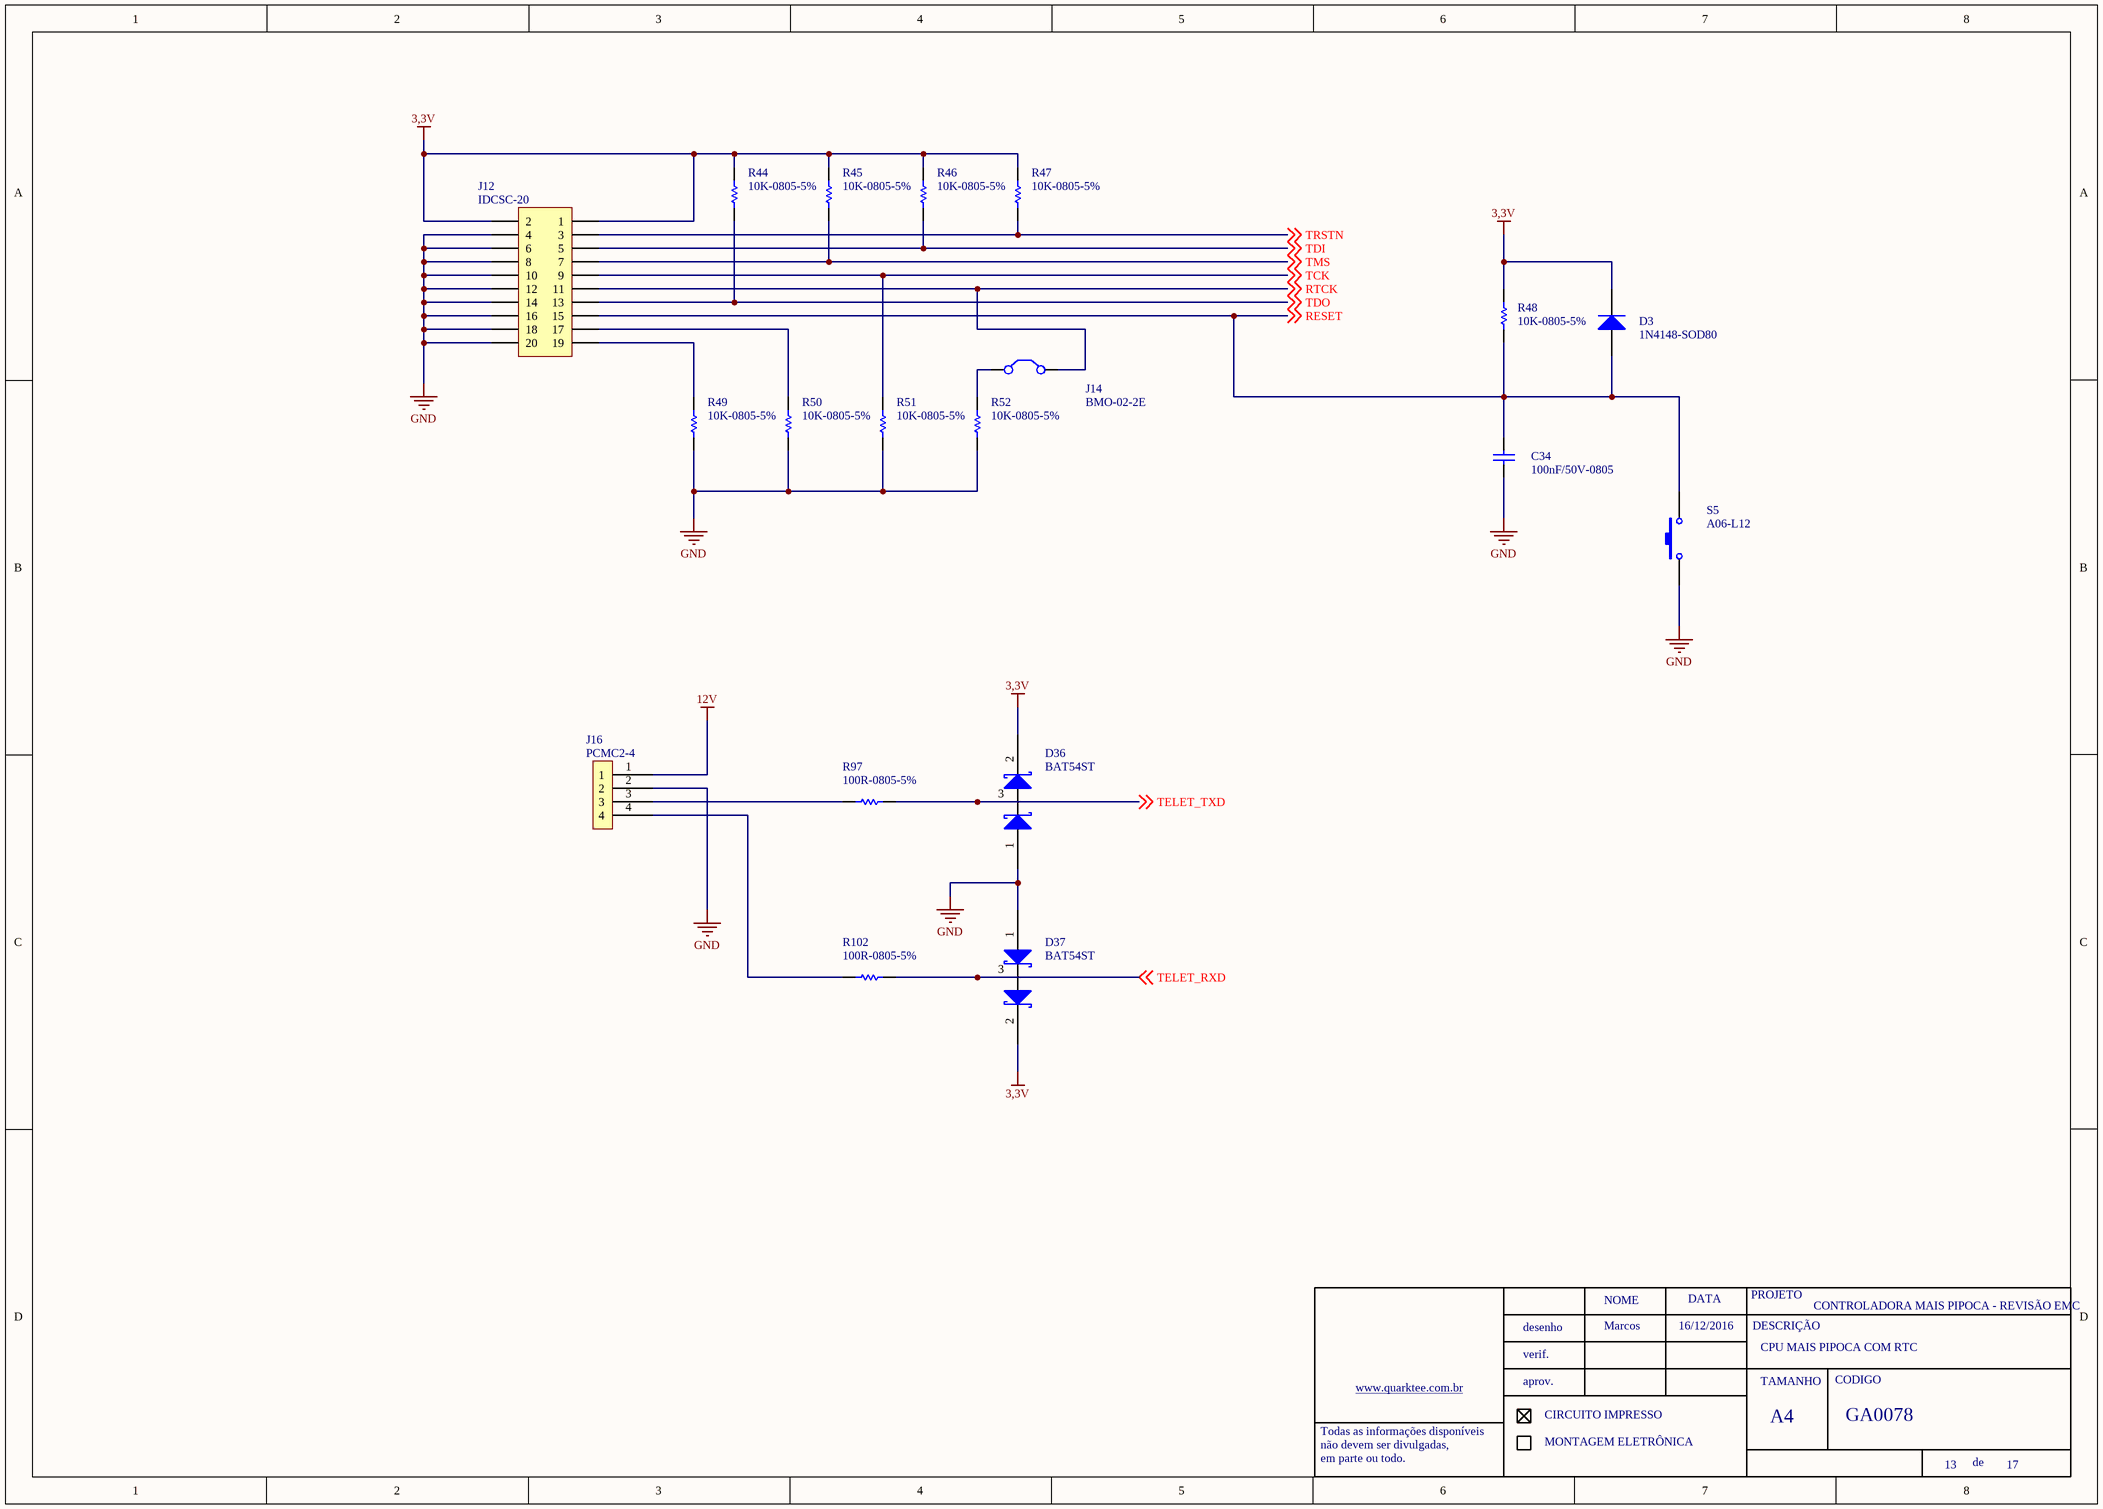
[diagram p5: JTAG.SchDoc]

### Parts
C34  100nF/50V-0805  [0805-REVISADO ONDA]
D3  1N4148-SOD80  [MINIMLEF/SOD80 - REVISADO ONDA]
D36  BAT54ST  [SOT23 - REVISADO ONDA]
D37  BAT54ST  [SOT23 - REVISADO ONDA]
J12  IDCSC-20  [IDCSC-20]
J14  BMO-02-2E  [JUMPER100]
J16  PCMC2-4  [PHMC4-04]
R44  10K-0805-5%  [0805-REVISADO ONDA]
R45  10K-0805-5%  [0805-REVISADO ONDA]
R46  10K-0805-5%  [0805-REVISADO ONDA]
R47  10K-0805-5%  [0805-REVISADO ONDA]
R48  10K-0805-5%  [0805-REVISADO ONDA]
R49  10K-0805-5%  [0805-REVISADO ONDA]
R50  10K-0805-5%  [0805-REVISADO ONDA]
R51  10K-0805-5%  [0805-REVISADO ONDA]
R52  10K-0805-5%  [0805-REVISADO ONDA]
R97  100R-0805-5%  [0805-REVISADO ONDA]
R102  100R-0805-5%  [0805-REVISADO ONDA]
S5  A06-L12  [CHAVE_A06]

### Nets
3,3V: D3.2 D36.2 D37.2 J12.1 J12.2 R44.1 R45.1 R46.1 R47.1 R48.2
12V: J16.1
GND: C34.1 D36.1 D37.1 J12.4 J12.6 J12.8 J12.10 J12.12 J12.14 J12.16 J12.18 J12.20 J16.2 R49.2 R50.2 R51.2 R52.2 S5.1
RESET: C34.2 D3.1 J12.15 R48.1 S5.2 ; off-sheet RESET
RTCK: J12.11 J14.2(C2) ; off-sheet RTCK
TCK: J12.9 R51.1 ; off-sheet TCK
TDI: J12.5 R46.2 ; off-sheet TDI
TDO: J12.13 R44.2 ; off-sheet TDO
TELET_RXD: D37.3 R102.2 ; off-sheet TELET_RXD
TELET_TXD: D36.3 R97.2 ; off-sheet TELET_TXD
TMS: J12.7 R45.2 ; off-sheet TMS
TRSTN: J12.3 R47.2 ; off-sheet TRSTN
NetJ12_17: J12.17 R50.1
NetJ12_19: J12.19 R49.1
NetJ14_1: J14.1(C1) R52.1
NetJ16_3: J16.3 R97.1
NetJ16_4: J16.4 R102.1

### Notes on the sheet
- Marcos
- 16/12/2016
- CPU MAIS PIPOCA COM RTC
- NOME
- DATA
- PROJETO
- DESCRIÇÃO
- www.quarktee.com.br
- desenho
- verif.
- aprov.
- TAMANHO
- CODIGO
- Todas as informações disponíveis
- não devem ser divulgadas,
- em parte ou todo.
- CIRCUITO IMPRESSO
- MONTAGEM ELETRÔNICA
- A4
- de

### Library data of the parts
C34 = 100nF/50-0805-NPO: ERP: 104.11.005
J12 = HEADER 10x2: BARRA DE PINOS 10x2 VIAS; ERP: 10 x 434.00.060
J14 = BARRA DE PINOS: ERP: 434.00.060
R44-R47 R49-R52 = RES 10K-0805: ERP: 103.03.054
D3 = 1N4148-SOD80: ERP: 120.19.001
R48 = 10K-0805-5%: ERP: 102.11.054
R97 R102 = 100R-0805-5%: ERP: 102.11.031
S5 = A06-L12: ERP: 136.00.001

## Sheet Meios_pagamento.SchDoc: CONTROLADORA MAIS PIPOCA - REVISÃO EMC
size A3; DocumentNumber: GA0078; SheetNumber: 11; SheetTotal: 17
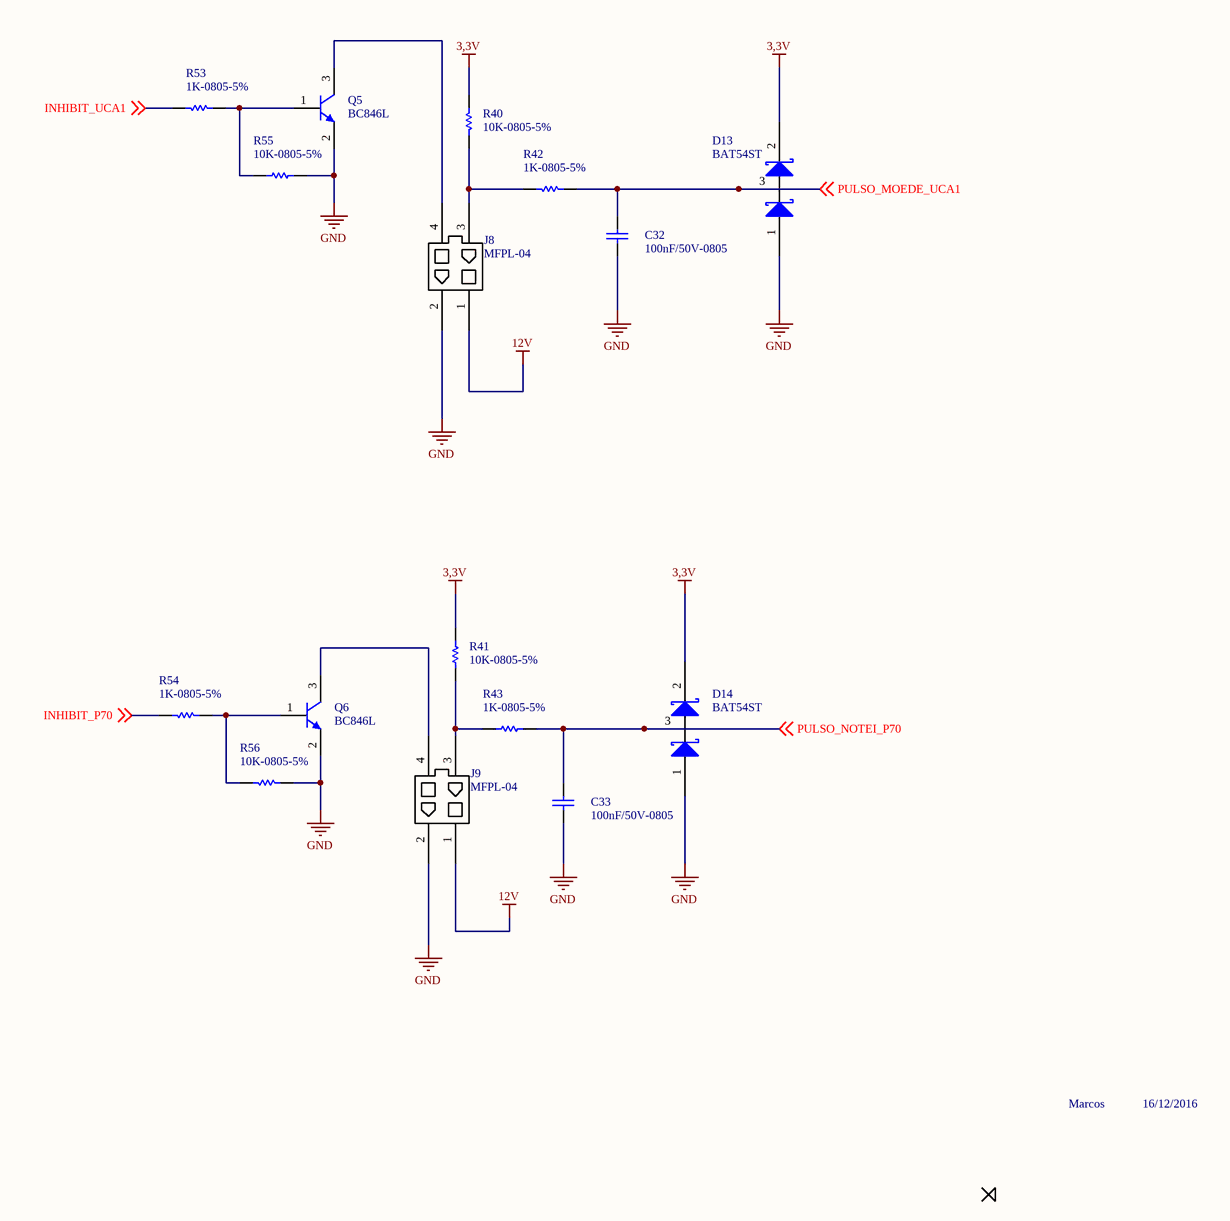
[diagram p6: Meios_pagamento.SchDoc]

### Parts
C32  100nF/50V-0805  [0805-REVISADO ONDA]
C33  100nF/50V-0805  [0805-REVISADO ONDA]
D13  BAT54ST  [SOT23 - REVISADO ONDA]
D14  BAT54ST  [SOT23 - REVISADO ONDA]
J8  MFPL-04
J9  MFPL-04
Q5  BC846L  [SOT23 - REVISADO ONDA]
Q6  BC846L  [SOT23 - REVISADO ONDA]
R40  10K-0805-5%  [0805-REVISADO ONDA]
R41  10K-0805-5%  [0805-REVISADO ONDA]
R42  1K-0805-5%  [0805-REVISADO ONDA]
R43  1K-0805-5%  [0805-REVISADO ONDA]
R53  1K-0805-5%  [0805-REVISADO ONDA]
R54  1K-0805-5%  [0805-REVISADO ONDA]
R55  10K-0805-5%  [0805-REVISADO ONDA]
R56  10K-0805-5%  [0805-REVISADO ONDA]

### Nets
3,3V: D13.2 D14.2 R40.2 R41.2
12V: J8.1 J9.1
GND: C32.1 C33.1 D13.1 D14.1 J8.2 J9.2 Q5.2(E) Q6.2(E) R55.2 R56.1
INHIBIT_P70: R54.2 ; off-sheet INHIBIT_P70
INHIBIT_UCA1: R53.2 ; off-sheet INHIBIT_UCA1
PULSO_MOEDE_UCA1: C32.2 D13.3 R42.1 ; off-sheet PULSO_MOEDE_UCA1
PULSO_NOTEI_P70: C33.2 D14.3 R43.2 ; off-sheet PULSO_NOTEI_P70
NetJ8_3: J8.3 R40.1 R42.2
NetJ8_4: J8.4 Q5.3(C)
NetJ9_3: J9.3 R41.1 R43.1
NetJ9_4: J9.4 Q6.3(C)
NetQ5_1: Q5.1(B) R53.1 R55.1
NetQ6_1: Q6.1(B) R54.1 R56.2

### Notes on the sheet
- Marcos
- 16/12/2016
- NOME
- DATA
- PROJETO
- DESCRIÇÃO
- desenho
- verif.
- aprov.
- TAMANHO
- CODIGO
- Todas as informações disponíveis
- não devem ser divulgadas,
- em parte ou todo.
- www.quarktee.com.br
- CIRCUITO IMPRESSO
- MONTAGEM ELETRÔNICA
- A4
- de

### Library data of the parts
C32 C33 = 100nF/50-0805-NPO: ERP: 104.11.005
Q5 Q6 = BC846: ERP: 106.22.001
R40 R41 R55 R56 = 10K-0805-5%: ERP: 102.11.054
R42 R43 R53 R54 = 1K-0805-5%: ERP: 102.11.042

## Sheet Porta_MDB.SchDoc: CONTROLADORA MAIS PIPOCA - REVISÃO EMC
size A3; DocumentNumber: GA0078; SheetNumber: 14; SheetTotal: 17
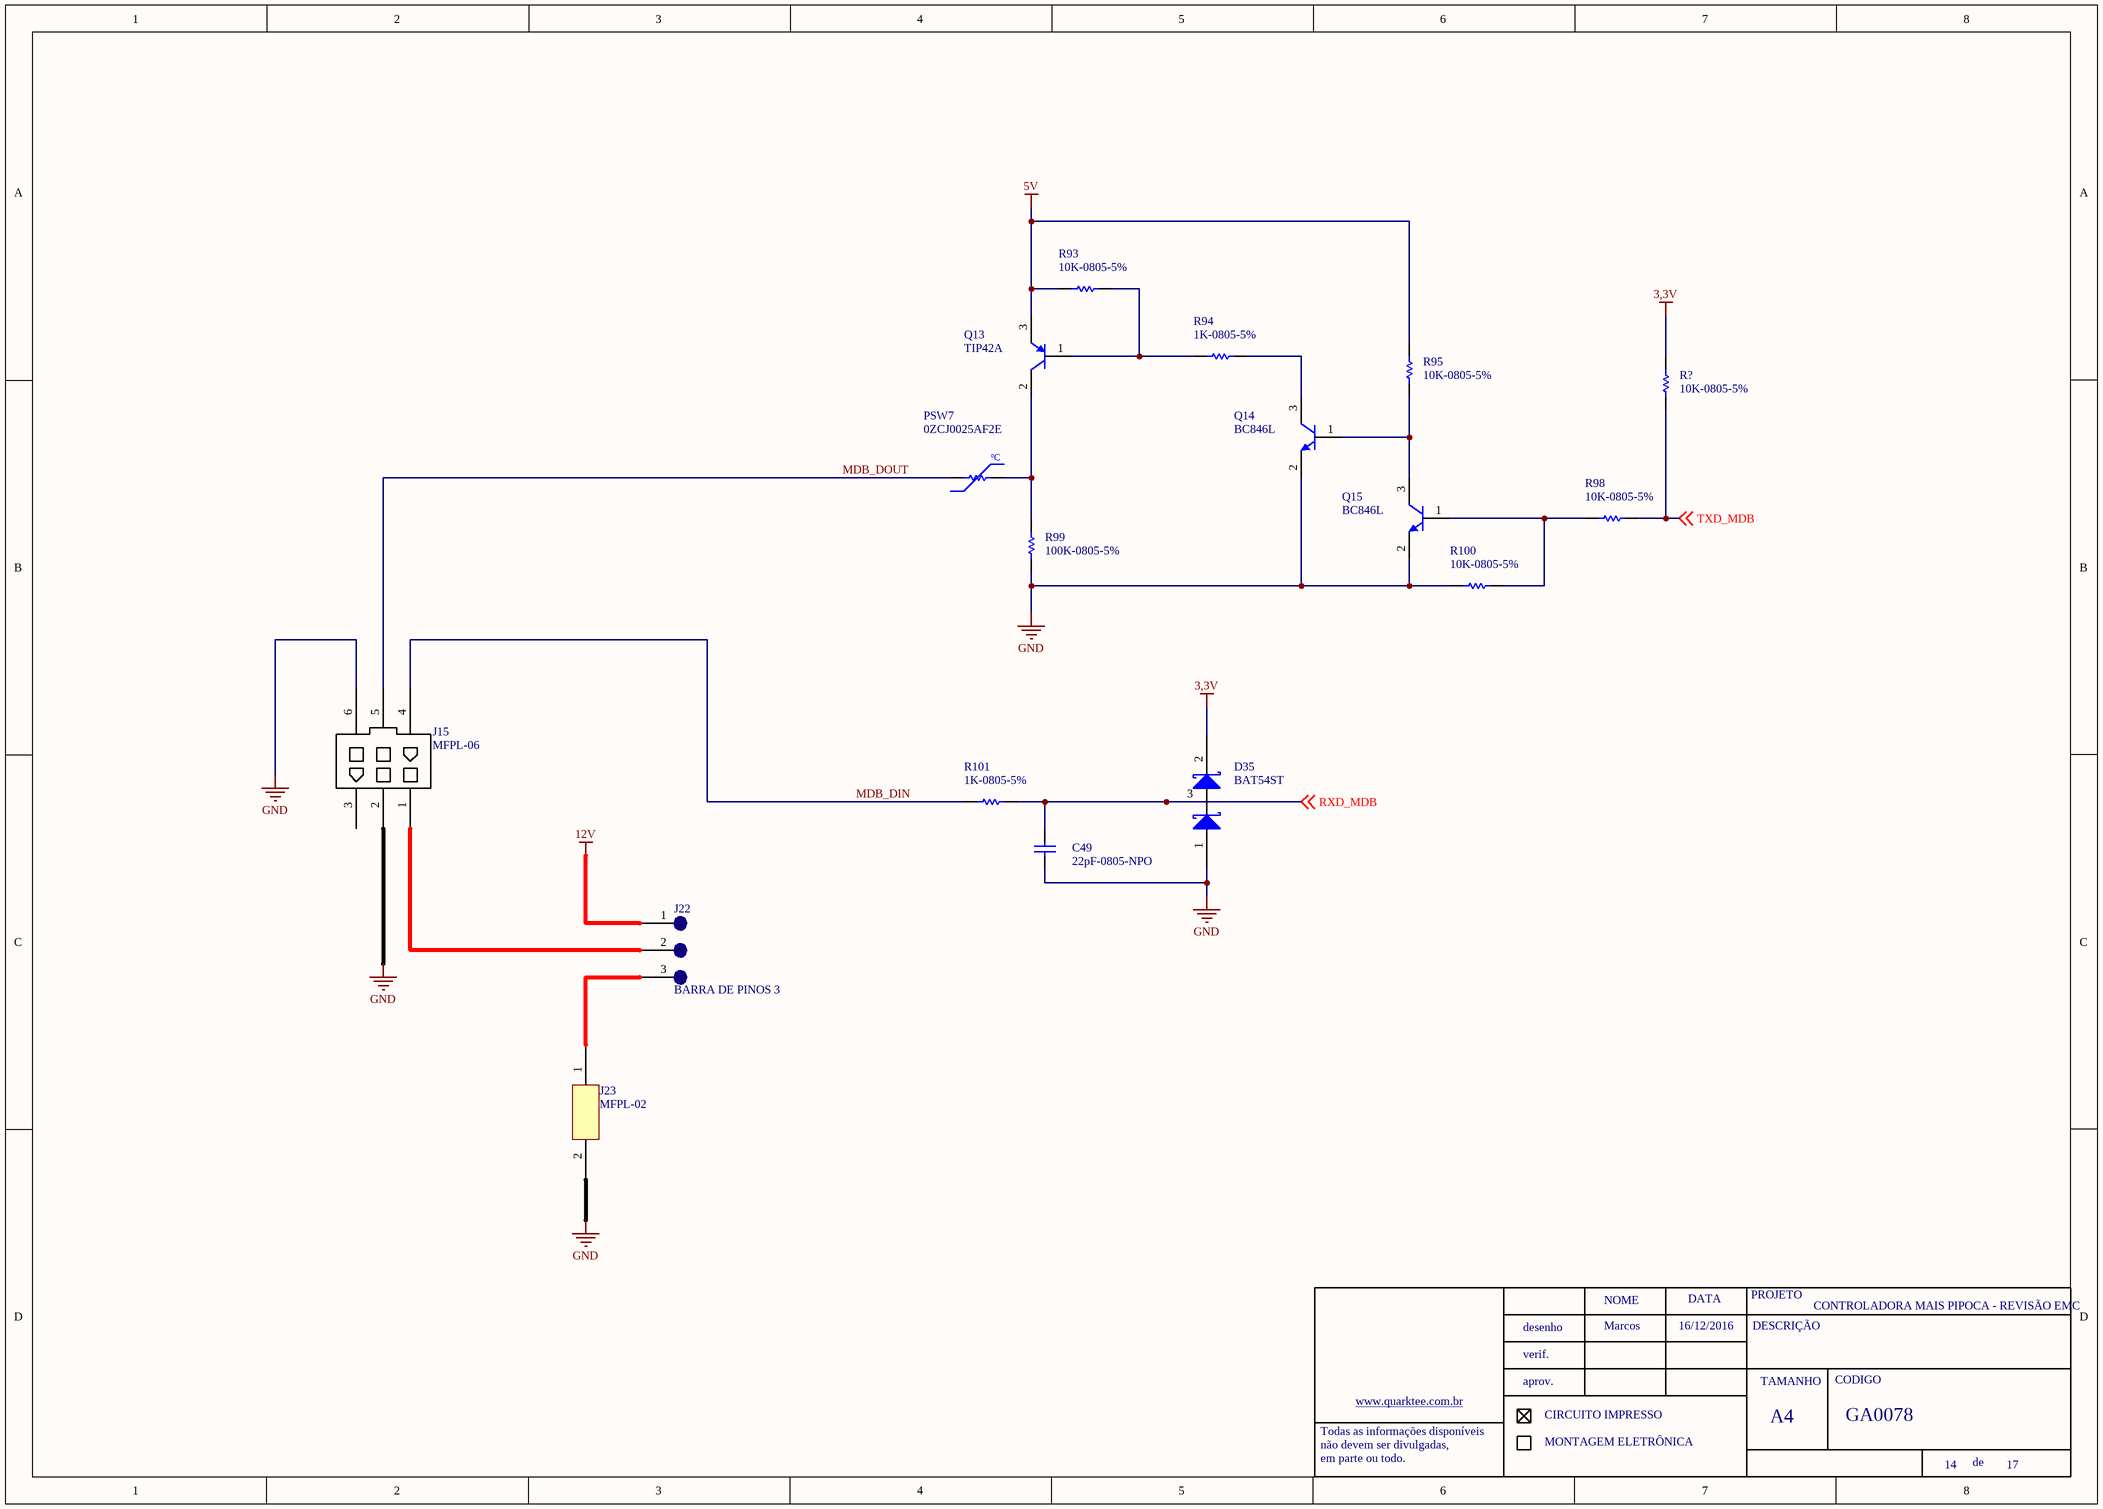
[diagram p7: Porta_MDB.SchDoc]

### Parts
C49  22pF-0805-NPO  [0805-REVISADO ONDA]
D35  BAT54ST  [SOT23 - REVISADO ONDA]
J15  MFPL-06
J22  BARRA DE PINOS 3
J23  MFPL-02
PSW7  0ZCJ0025AF2E  [1206-REVISADO ONDA]
Q13  TIP42A  [DPAK REVISADO ONDA]
Q14  BC846L  [SOT23 - REVISADO ONDA]
Q15  BC846L  [SOT23 - REVISADO ONDA]
R93  10K-0805-5%  [0805-REVISADO ONDA]
R94  1K-0805-5%  [0805-REVISADO ONDA]
R95  10K-0805-5%  [0805-REVISADO ONDA]
R98  10K-0805-5%  [0805-REVISADO ONDA]
R99  100K-0805-5%  [0805-REVISADO ONDA]
R100  10K-0805-5%  [0805-REVISADO ONDA]
R101  1K-0805-5%  [0805-REVISADO ONDA]
R?  10K-0805-5%  [0805-REVISADO ONDA]

### Nets
3,3V: D35.2 R?.2
5V: Q13.3(E) R93.1 R95.2
12V: J22.1
GND: C49.1 D35.1 J15.2 J15.6 J23.2 Q14.2(E) Q15.2(E) R99.1 R100.1
MDB_DIN: J15.4 R101.1
MDB_DOUT: J15.5 PSW7.1
RXD_MDB: C49.2 D35.3 R101.2 ; off-sheet RXD_MDB
TXD_MDB: R98.2 R?.1 ; off-sheet TXD_MDB
NetJ15_1: J15.1 J22.2
NetJ22_3: J22.3 J23.1
NetPSW7_2: PSW7.2 Q13.2(C) R99.2
NetQ13_1: Q13.1(B) R93.2 R94.1
NetQ14_1: Q14.1(B) Q15.3(C) R95.1
NetQ14_3: Q14.3(C) R94.2
NetQ15_1: Q15.1(B) R98.1 R100.2

Not connected (* = marked no-connect by the designer): J15 3

### Notes on the sheet
- Marcos
- 16/12/2016
- NOME
- DATA
- PROJETO
- DESCRIÇÃO
- desenho
- verif.
- aprov.
- TAMANHO
- CODIGO
- Todas as informações disponíveis
- não devem ser divulgadas,
- em parte ou todo.
- www.quarktee.com.br
- CIRCUITO IMPRESSO
- MONTAGEM ELETRÔNICA
- A4
- de
- (in symbol PTC 2A-120V) ºC

### Library data of the parts
J22 = JUMPER 3
PSW7 = PTC 2A-120V
Q14 Q15 = BC846: ERP: 106.22.001
C49 = 22pF-0805-NPO: ERP: 104.11.001
Q13 = TIP42A: ERP: 107.01.007
R93 R95 R98 R100 R? = 10K-0805-5%: ERP: 102.11.054
R94 R101 = 1K-0805-5%: ERP: 102.11.042
R99 = 100K-0805-5%: ERP: 102.11.066

## Sheet Regulador.SchDoc: GRUPO ALTECH
size A3; DocumentNumber: GA0078; SheetNumber: 16; SheetTotal: 16
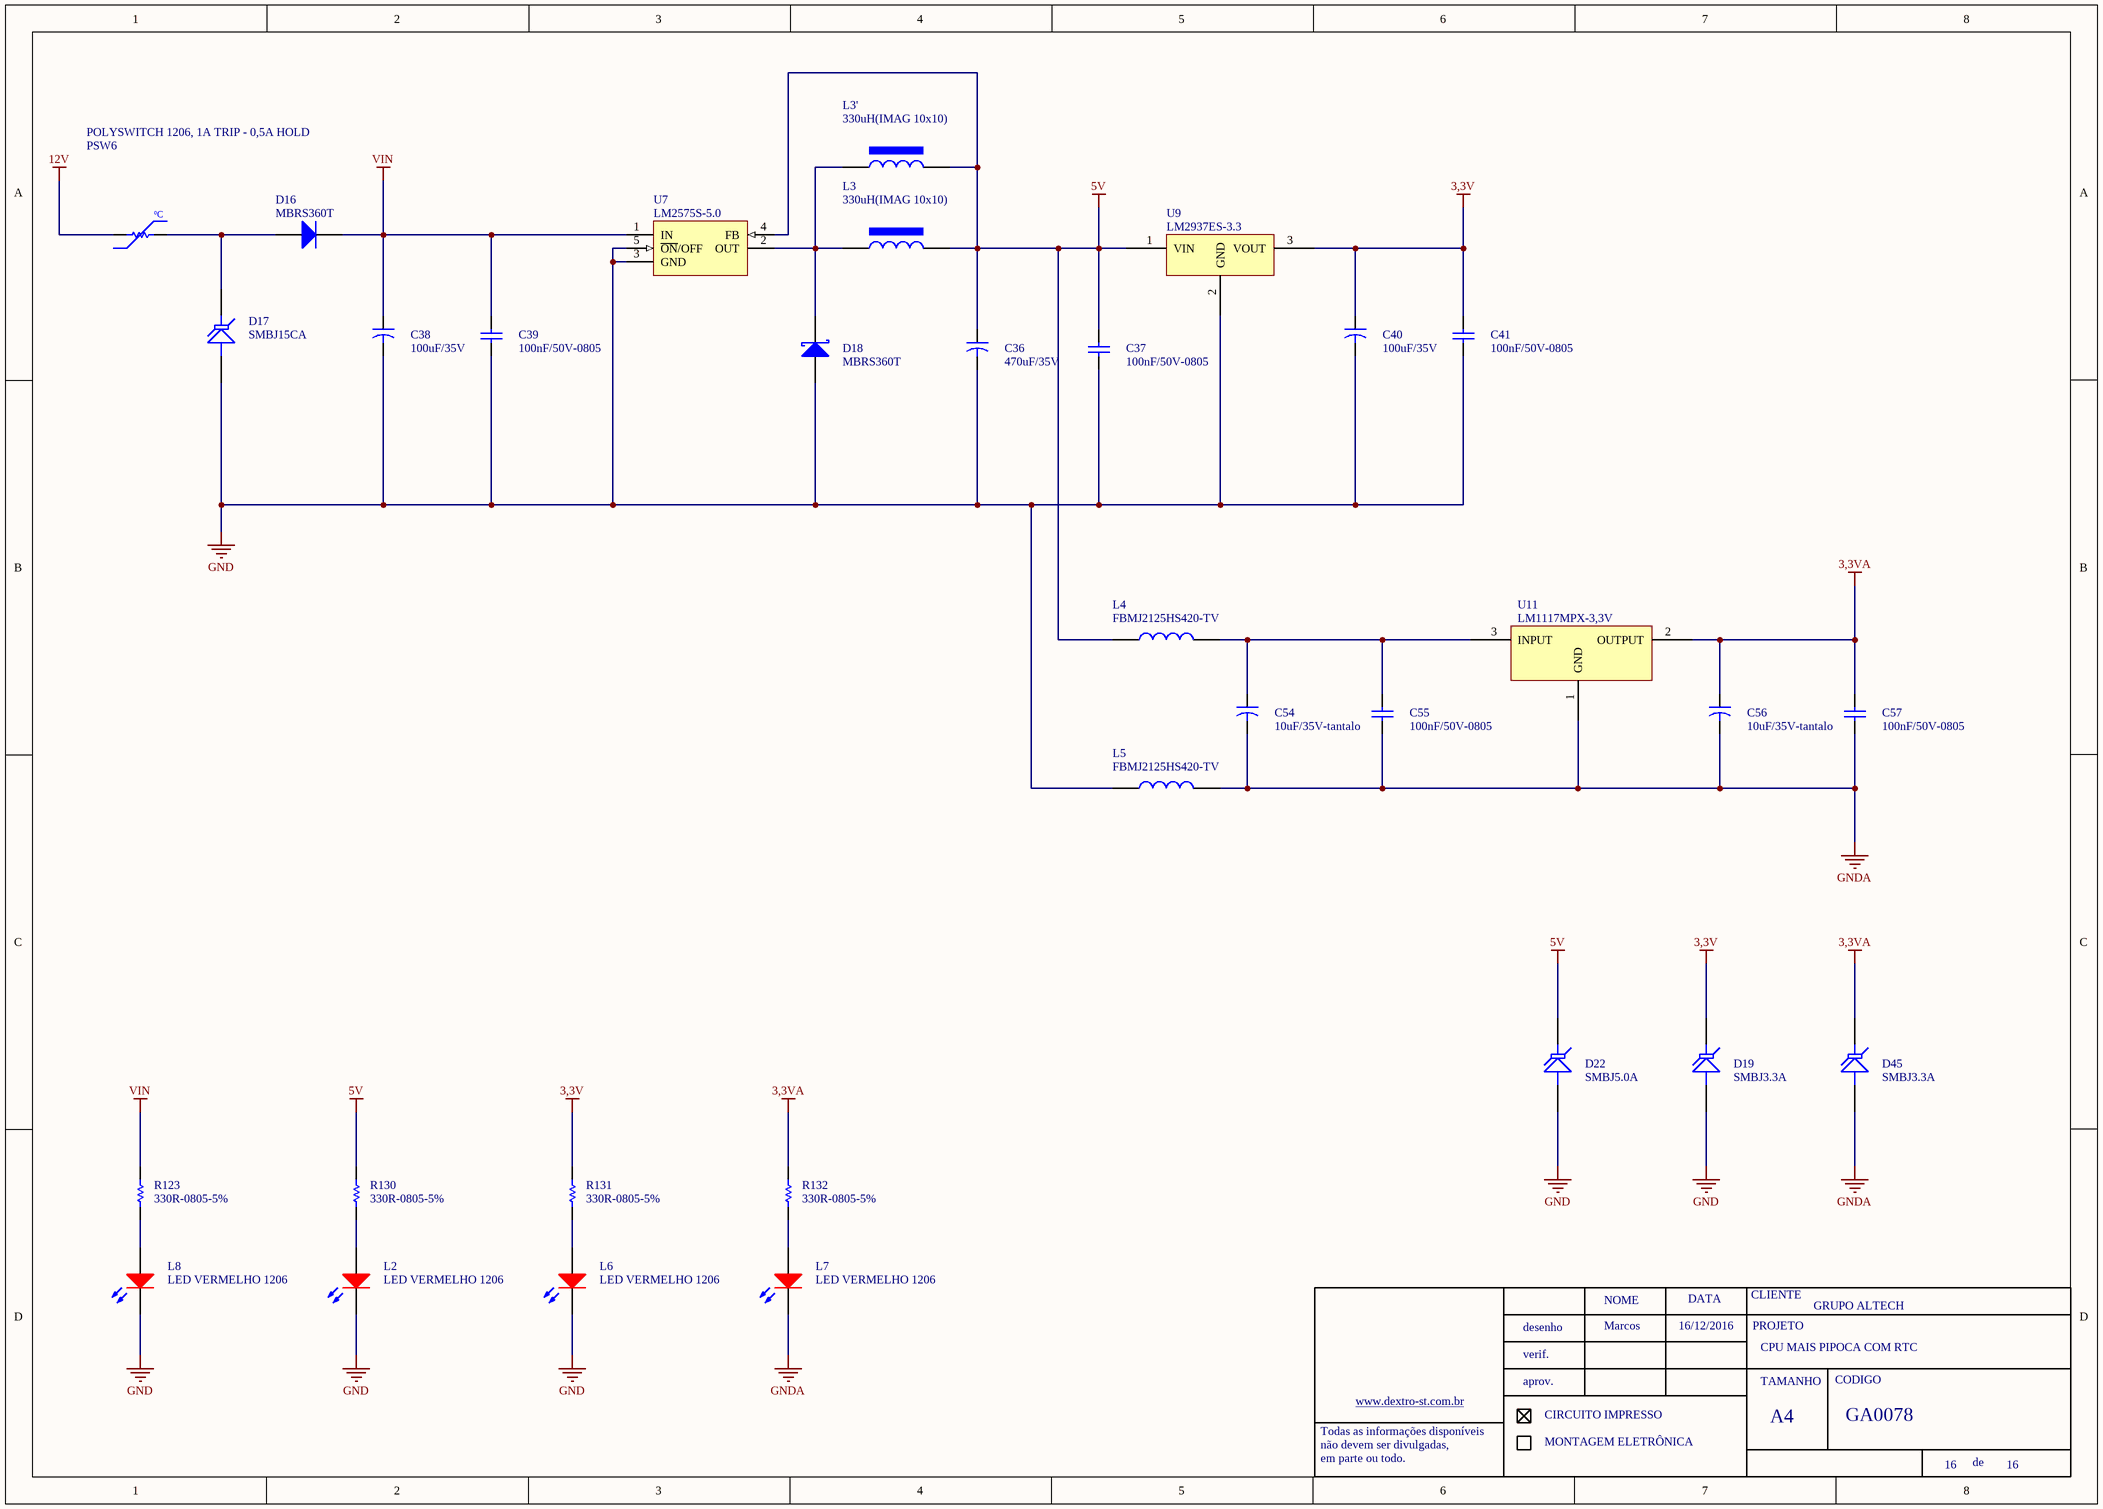
[diagram p8: Regulador.SchDoc]

### Parts
C36  470uF/35V  [CAP POL 8x12mm]
C37  100nF/50V-0805  [0805-REVISADO ONDA]
C38  100uF/35V  [CAP POL 8x12mm]
C39  100nF/50V-0805  [0805-REVISADO ONDA]
C40  100uF/35V  [CAP POL 8x12mm]
C41  100nF/50V-0805  [0805-REVISADO ONDA]
C54  10uF/35V-tantalo  [tantalo vishay E]
C55  100nF/50V-0805  [0805-REVISADO ONDA]
C56  10uF/35V-tantalo  [tantalo vishay E]
C57  100nF/50V-0805  [0805-REVISADO ONDA]
D16  MBRS360T  [DO-214AB]
D17  SMBJ15CA  [DO-214AA]
D18  MBRS360T  [DO-214AB]
D19  SMBJ3.3A  [DO-214AA]
D22  SMBJ5.0A  [DO-214AA]
D45  SMBJ3.3A  [DO-214AA]
L2  LED VERMELHO 1206  [LED 1206]
L3  330uH(IMAG 10x10)  [INDUTOR 47mH]
L3'  330uH(IMAG 10x10)  [INDUTOR 47mH]
L4  FBMJ2125HS420-TV  [0805-REVISADO ONDA]
L5  FBMJ2125HS420-TV  [0805-REVISADO ONDA]
L6  LED VERMELHO 1206  [LED 1206]
L7  LED VERMELHO 1206  [LED 1206]
L8  LED VERMELHO 1206  [LED 1206]
PSW6  POLYSWITCH 1206, 1A TRIP - 0,5A HOLD  [1206-REVISADO ONDA]
R123  330R-0805-5%  [0805-REVISADO ONDA]
R130  330R-0805-5%  [0805-REVISADO ONDA]
R131  330R-0805-5%  [0805-REVISADO ONDA]
R132  330R-0805-5%  [0805-REVISADO ONDA]
U7  LM2575S-5.0  [TO-263-5]
U9  LM2937ES-3.3  [TO-263]
U11  LM1117MPX-3,3V  [SOT223]

### Nets
3,3V: C40.1 C41.2 D19.2(K) R131.2 U9.3(VOUT)
3,3VA: C56.1 C57.2 D45.2(K) R132.2 U11.2(OUTPUT)
5V: C36.1 C37.2 D22.2(K) L3.1 L3'.1 L4.1 R130.2 U7.4(FB) U9.1(VIN)
12V: PSW6.1
GND: C36.2 C37.1 C38.2 C39.1 C40.2 C41.1 D17.1(A) D18.1(A) D19.1(A) D22.1(A) L2.2(K) L5.1 L6.2(K) L8.2(K) U7.3(GND) U7.5(~{ON}/OFF) U9.2(GND)
GNDA: C54.2 C55.1 C56.2 C57.1 D45.1(A) L5.2 L7.2(K) U11.1(GND)
VIN: C38.1 C39.2 D16.2(K) R123.2 U7.1(IN)
NetC54_1: C54.1 C55.2 L4.2 U11.3(INPUT)
NetD16_1: D16.1(A) D17.2(K) PSW6.2
NetD18_2: D18.2(K) L3.2 L3'.2 U7.2(OUT)
NetL2_1: L2.1(A) R130.1
NetL6_1: L6.1(A) R131.1
NetL7_1: L7.1(A) R132.1
NetL8_1: L8.1(A) R123.1

### Notes on the sheet
- Marcos
- 16/12/2016
- CPU MAIS PIPOCA COM RTC
- NOME
- DATA
- CLIENTE
- PROJETO
- desenho
- verif.
- aprov.
- TAMANHO
- CODIGO
- Todas as informações disponíveis
- não devem ser divulgadas,
- em parte ou todo.
- www.dextro-st.com.br
- CIRCUITO IMPRESSO
- MONTAGEM ELETRÔNICA
- A4
- de
- (in symbol PTC 2A-120V) ºC

### Library data of the parts
C36 C38 C40 = 100uF/50V: ERP: 105.01.003
C37 C39 C41 C55 C57 = 100nF/50-0805-NPO: ERP: 104.11.005
D16 = 1N4007: ERP: 120.18.001
D17 = SMBJ30.0A: ERP: 128.02.003
D18 = 1N5819-SOD80: ERP: 121.18.003
D19 D45 = SMBJ5.0A: ERP: 128.02.002
L2 L6-L8 = LED VERMELHO 0603 SMD: ERP: 124.02.010
L3 L3' = indutor 1mH CNF15: 1mH-CNF15-26 AWG; ERP: 211.00.012
L4 L5 = FERRITE BEAD 2K7-100MHZ - 200 mA - 800mOHM DC
PSW6 = PTC 2A-120V
R123 R130-R132 = 1K-0805-5%: ERP: 102.11.042
U9 = LM3940IT-3.3-TO220: LM2937; ERP: 115.01.001
U11 = LM1117MPX-3,3V-SOT223: ERP: 115.01.011
C54 C56 = 10uF/35V-tantalo: ERP: 104.11.011
D22 = SMBJ5.0A: ERP: 128.02.002
U7 = LM2575S-5.0: ERP: 115.01.020

## Nets that join several sheets
3,3V: Barreira_pacote (D15.2), CPU (17 pins), IHM (R25.1 R26.1 R27.1 R28.1), InterfaceConfiguracao (C27.2 C51.2 U6.16), JTAG (10 pins), Meios_pagamento (D13.2 D14.2 R40.2 R41.2), Porta_MDB (D35.2 R?.2), Regulador (5 pins)
3,3VA: CPU (U4.10 U4.12), Regulador (5 pins)
5V: amplificadorAudio (R80.1), Barreira_pacote (R57.2 R58.2), IHM (7 pins), InterfaceConfiguracao (C72.2 U10.16 U13.4 U13.20), Porta_MDB (Q13.3 R93.1 R95.2), Regulador (9 pins)
12V: amplificadorAudio (6 pins), Barreira_pacote (J11.1), JTAG (J16.1), Meios_pagamento (J8.1 J9.1), Porta_MDB (J22.1), Regulador (PSW6.1)
GND: amplificadorAudio (30 pins), Barreira_pacote (5 pins), CPU (20 pins), IHM (13 pins), InterfaceConfiguracao (27 pins), JTAG (18 pins), Meios_pagamento (10 pins), Porta_MDB (9 pins), Regulador (17 pins)
GNDA: CPU (U4.11 U4.15), Regulador (8 pins)
AUDIO: amplificadorAudio (R1.1), CPU (U4.6)
DEC: CPU (U4.90), IHM (R27.2 S3.2)
ENTER: CPU (U4.89), IHM (R28.2 S4.2)
ESC: CPU (U4.92), IHM (R25.2 S1.2)
INC: CPU (U4.91), IHM (R26.2 S2.2)
INHIBIT_P70: CPU (U4.39), Meios_pagamento (R54.2)
INHIBIT_UCA1: CPU (U4.38), Meios_pagamento (R53.2)
LCD2_D4: CPU (U4.67), IHM (U5.4)
LCD2_D5: CPU (U4.66), IHM (U5.5)
LCD2_D6: CPU (U4.65), IHM (U5.6)
LCD2_D7: CPU (U4.64), IHM (U5.7)
LCD2_ENABLE: CPU (U4.69), IHM (U5.3)
LCD2_RS: CPU (U4.68), IHM (U5.2)
LCD_D4: CPU (U4.93), IHM (R34.2)
LCD_D5: CPU (U4.94), IHM (R32.2)
LCD_D6: CPU (U4.80), IHM (R31.2)
LCD_D7: CPU (U4.81), IHM (R30.2)
LCD_ENABLE: CPU (U4.86), IHM (LCD1.6)
LCD_RS: CPU (U4.7), IHM (LCD1.4)
PULSO_MOEDE_UCA1: CPU (U4.51), Meios_pagamento (C32.2 D13.3 R42.1)
PULSO_NOTEI_P70: CPU (U4.50), Meios_pagamento (C33.2 D14.3 R43.2)
RESET: CPU (U4.17), JTAG (5 pins)
RTCK: CPU (U4.100), JTAG (J12.11 J14.2)
RXD_MDB: CPU (U4.49), Porta_MDB (C49.2 D35.3 R101.2)
RXD_MOEDEIRO: Barreira_pacote (D15.3 R59.2), CPU (U4.99)
RXD_PROG: CPU (R64.1 U4.47), InterfaceConfiguracao (U10.3)
SAIDA_01: CPU (U4.95), IHM (U5.8)
SEL_PROG_DEX_A: CPU (U4.43), InterfaceConfiguracao (U10.10)
SEL_PROG_DEX_B: CPU (U4.56), InterfaceConfiguracao (U10.9)
TCK: CPU (U4.5), JTAG (J12.9 R51.1)
TDI: CPU (U4.2), JTAG (J12.5 R46.2)
TDO: CPU (U4.1), JTAG (J12.13 R44.2)
TELET_RXD: CPU (U4.74), JTAG (D37.3 R102.2)
TELET_TXD: CPU (U4.75), JTAG (D36.3 R97.2)
TMS: CPU (U4.3), JTAG (J12.7 R45.2)
TRSTN: CPU (U4.4), JTAG (J12.3 R47.2)
TXD_MDB: CPU (U4.48), Porta_MDB (R98.2 R?.1)
TXD_MOEDEIRO: Barreira_pacote (R60.2), CPU (U4.98)
TXD_PROG: CPU (R63.1 U4.46), InterfaceConfiguracao (U10.13)